# EasyEDA Pro project ease_eda.epro

# Schematic Schematic1
Board Name: Board1; Create Date: 2026-01-07; Page Name: P1; Project Name: QuizBox; Schematic Name: Schematic1; Update Date: 2026-01-18; Company: EasyEDA.com; Page Size: A4; Version: V1.0
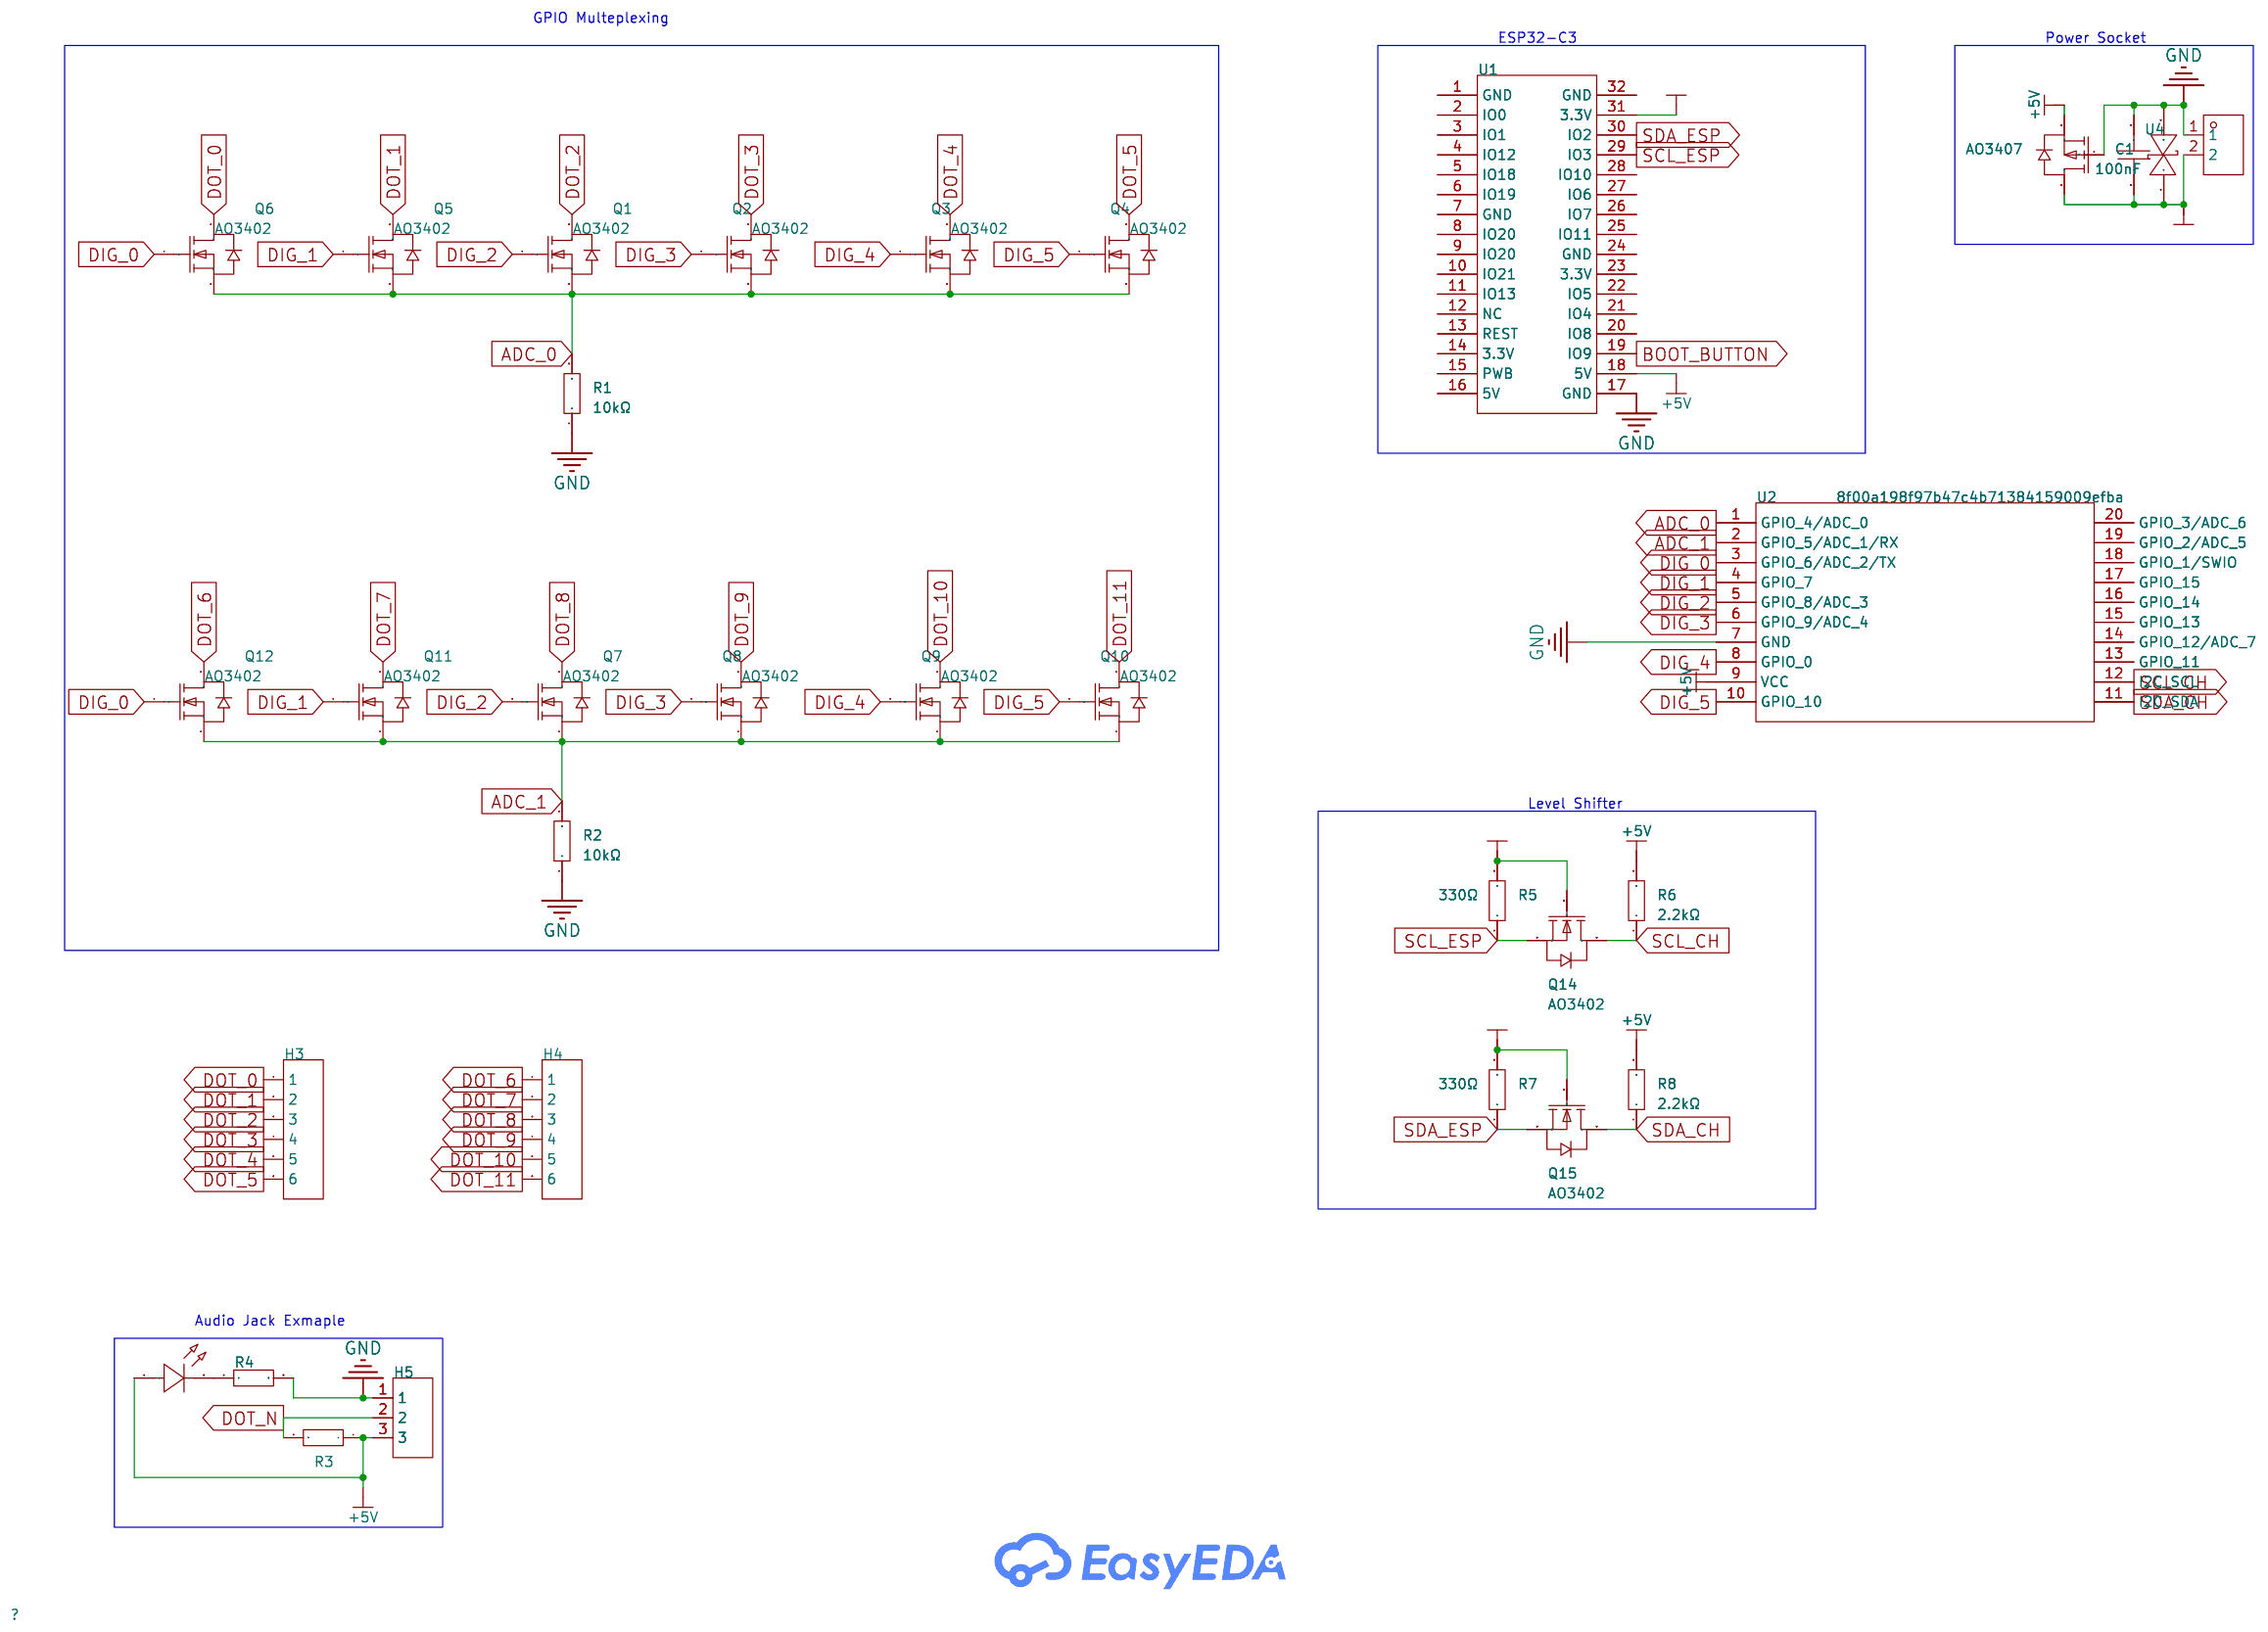
[diagram p0: schematic sheet]

## Parts
C1  100nF  [C1206]
H3  2.54-1x6P直针  [HDR-TH_6P-P2.54-V-M-1]
H4  2.54-1x6P直针  [HDR-TH_6P-P2.54-V-M-1]
H5  HX PH254-01-03-Z-L11.5 pcb pin header  [HDR-TH_3P-P2.54-V-M-1]
LED1  BL-BUB1V4V-AT  [LED-TH_BD5.8-P2.54-FD_RED]
Q1  AO3402  [SOT-23-3_L2.9-W1.3-P1.90-LS2.4-BR]
Q2  AO3402  [SOT-23-3_L2.9-W1.3-P1.90-LS2.4-BR]
Q3  AO3402  [SOT-23-3_L2.9-W1.3-P1.90-LS2.4-BR]
Q4  AO3402  [SOT-23-3_L2.9-W1.3-P1.90-LS2.4-BR]
Q5  AO3402  [SOT-23-3_L2.9-W1.3-P1.90-LS2.4-BR]
Q6  AO3402  [SOT-23-3_L2.9-W1.3-P1.90-LS2.4-BR]
Q7  AO3402  [SOT-23-3_L2.9-W1.3-P1.90-LS2.4-BR]
Q8  AO3402  [SOT-23-3_L2.9-W1.3-P1.90-LS2.4-BR]
Q9  AO3402  [SOT-23-3_L2.9-W1.3-P1.90-LS2.4-BR]
Q10  AO3402  [SOT-23-3_L2.9-W1.3-P1.90-LS2.4-BR]
Q11  AO3402  [SOT-23-3_L2.9-W1.3-P1.90-LS2.4-BR]
Q12  AO3402  [SOT-23-3_L2.9-W1.3-P1.90-LS2.4-BR]
Q13  AO3407  [SOT-23-3_L2.9-W1.3-P0.95-LS2.4-BR]
Q14  AO3402  [SOT-23-3_L2.9-W1.6-P1.90-LS2.8-BR]
Q15  AO3402  [SOT-23-3_L2.9-W1.6-P1.90-LS2.8-BR]
R1  10kΩ  [RES-TH_BD1.8-L3.2-P7.20-D0.4]
R2  10kΩ  [RES-TH_BD1.8-L3.2-P7.20-D0.4]
R3  10K  [R0603]
R4  10K  [R0603]
R5  330Ω  [RES-TH_BD1.8-L3.2-P7.20-D0.4]
R6  2.2kΩ  [RES-TH_BD1.8-L3.2-P7.20-D0.4]
R7  330Ω  [RES-TH_BD1.8-L3.2-P7.20-D0.4]
R8  2.2kΩ  [RES-TH_BD1.8-L3.2-P7.20-D0.4]
U1  -  [ESP32C3 LUATOS FOOT]
U2  8f00a198f97b47c4b71384159009efba  [DIP-20_L25.4-W17.7-P2.54-LS15.2-BL]
U3  KF301-5.0-2P  [CONN-TH_P5.00_KF301-5.0-2P]
U4  PESD5V0S1BA  [SOD-323_L1.7-W1.3-LS2.5-BI]

## Library data of the parts
C1 = CAP_0603: Supplier Footprint: 0603
H3 H4 = 2.54-1x6P直针: Pin Structure:1x6P Pitch:2.54mm Row Spacing:- Circluar Pins/Square Pins:Pin Header Mounting Type:Through Hole Number of Rows:1 Number of Pins:6P Current Rating:3A Voltage Rating (Max):- Length of Mating Pin:6mm Insulation Height:2.5mm Length of End Connec; LCSC Part Name: 1x6P 间距:2.54mm 方针 直插; Supplier Part: C37208; Manufacturer: BOOMELE(博穆精密); Supplier Footprint: 插件,P=2.54mm; JLCPCB Part Class: Extended Part; Datasheet: https://item.szlcsc.com/datasheet/2.54-1x6P%25E7%259B%25B4%25E9%2592%2588/38187.html; Supplier: LCSC; Pin Structure: 1x6P; Pitch: 2.54mm; Circluar Pins/Square Pins: Pin Header; Mounting Type: Through Hole; Number of Rows: 1; Number of Pins: 6P; Current Rating: 3A; Length of Mating Pin: 6mm; Insulation Height: 2.5mm; Length of End Connection Pin: 3mm; Contact Material: Brass; Contact Plating: Gold; Operating Temperature: -40℃~+105℃; Color: Black
H5 = HX PH254-01-03-Z-L11.5 pcb pin header: Pin Structure:1x3P Pitch:2.54mm Circluar Pins/Square Pins:Pin Header Mounting Type:Through Hole Number of Rows:1 Number of Pins:3P Current Rating:3A Voltage Rating (Max):1kV Length of Mating Pin:6mm Insulation Height:2.5mm Length of End Connection Pin:3mm; LCSC Part Name: 1x3P 间距:2.54mm 方针 直插; Supplier Part: C52016391; Manufacturer: hanxia(韩下); Supplier Footprint: 插件,P=2.54mm; JLCPCB Part Class: Extended Part; Datasheet: https://item.szlcsc.com/datasheet/HX%2520PH254-01-03-Z-L11.5%2520pcb%2520pin%2520header/54760436.html; Supplier: LCSC; Pin Structure: 1x3P; Pitch: 2.54mm; Circluar Pins/Square Pins: Pin Header; Mounting Type: Through Hole; Number of Rows: 1; Number of Pins: 3P; Current Rating: 3A; Voltage Rating (Max): 1kV; Length of Mating Pin: 6mm; Insulation Height: 2.5mm; Length of End Connection Pin: 3mm; Contact Material: Brass; Contact Plating: Gold; Operating Temperature: -40℃~+105℃
LED1 = BL-BUB1V4V-AT: Illumination Color:Red Forward Current:-; LCSC Part Name: F4.98红发红红光; Supplier Part: C7421379; Manufacturer: BrtLed(佰鸿); Supplier Footprint: 插件; JLCPCB Part Class: Extended Part; Datasheet: https://item.szlcsc.com/datasheet/BL-BUB1V4V-AT/8401795.html; Supplier: LCSC; Illumination Color: Red
Q1-Q12 = AO3402_C50176481: Drain to Source Voltage:30V Current - Continuous Drain(Id):4.2A RDS(on):38mΩ@10V Gate Threshold Voltage (Vgs(th)):800mV Gate Charge(Qg):3.1nC@4.5V Input Capacitance(Ciss):240pF Reverse Transfer Capacitance (Crss@Vds):30pF Type:N-Channel Output Capacitance; Supplier Part: C50176481; Manufacturer: SEP(威旺); Supplier Footprint: SOT-23; JLCPCB Part Class: Extended Part; Datasheet: https://item.szlcsc.com/datasheet/AO3402/52750371.html; Supplier: LCSC; Drain to Source Voltage: 30V; Current - Continuous Drain(Id): 4.2A; RDS(on): 38mΩ@10V; Gate Threshold Voltage (Vgs(th)): 800mV; Gate Charge(Qg): 3.1nC@4.5V; Input Capacitance(Ciss): 240pF; Reverse Transfer Capacitance (Crss@Vds): 30pF; Type: N-Channel; Output Capacitance(Coss): 35pF
Q13 = AO3407_C5370970: Drain to Source Voltage:30V Current - Continuous Drain(Id):4.1A RDS(on):55mΩ@10V Pd - Power Dissipation:1.51W Gate Threshold Voltage (Vgs(th)):1.5V Gate Charge(Qg):6.8nC@10V Input Capacitance(Ciss):580pF@15V Reverse Transfer Capacitance (Crss@Vds):74pF@15; LCSC Part Name: 耐压:30V 电流:4.1A; Supplier Part: C5370970; Manufacturer: TECH PUBLIC(台舟); Supplier Footprint: SOT-23-3; JLCPCB Part Class: Extended Part; Datasheet: https://item.szlcsc.com/datasheet/AO3407/6218007.html; Supplier: LCSC; Drain to Source Voltage: 30V; Current - Continuous Drain(Id): 4.1A; RDS(on): 55mΩ@10V; Pd - Power Dissipation: 1.51W; Gate Threshold Voltage (Vgs(th)): 1.5V; Gate Charge(Qg): 6.8nC@10V; Input Capacitance(Ciss): 580pF@15V; Reverse Transfer Capacitance (Crss@Vds): 74pF@15V; Operating Temperature: -55℃~+150℃; Output Capacitance(Coss): 98pF
Q14 Q15 = AO3402_C5379095: Number:1 N-Channel Drain to Source Voltage:30V Current - Continuous Drain(Id):4A RDS(on):47mΩ@4.5V Pd - Power Dissipation:1.4W Gate Threshold Voltage (Vgs(th)):900mV@250uA Gate Charge(Qg):8.4nC@4.5V Input Capacitance(Ciss):695pF Reverse Transfer Capacitan; LCSC Part Name: 1个N沟道 耐压:30V 电流:4A; Supplier Part: C5379095; Manufacturer: MSKSEMI(美森科); Supplier Footprint: SOT-23-3L; JLCPCB Part Class: Extended Part; Datasheet: https://item.szlcsc.com/datasheet/AO3402/6243219.html; Supplier: LCSC; Number: 1 N-Channel; Drain to Source Voltage: 30V; Current - Continuous Drain(Id): 4A; RDS(on): 47mΩ@4.5V; Pd - Power Dissipation: 1.4W; Gate Threshold Voltage (Vgs(th)): 900mV@250uA; Gate Charge(Qg): 8.4nC@4.5V; Input Capacitance(Ciss): 695pF; Reverse Transfer Capacitance (Crss@Vds): 36pF; Operating Temperature: -55℃~+150℃; Output Capacitance(Coss): 45pF
R1 R2 R5-R8 = Res_AXIAL-1/8W: Supplier Footprint: Through
R3 R4 = Res_0603: Supplier Footprint: 0603
U1 = ESP32-C3-LUATOS
U2 = CH32V003_EXPANDER
U3 = KF301-5.0-2P: Number of Positions or Pins:1x2P Pitch:5mm Color:Blue Mounting Type:Through Hole Number of Pins:2P Number of Rows:1 Number of PINs Per Row:2 Current Rating:17A Voltage Rating (Max):250V Wire Gauge - AWG:14~22 Wire Gauge - mm2:1.5 Wire Gauge - mm2:1.5 Oper; LCSC Part Name: 1x2P 5mm 直插 排数:1 每排P数:2; Supplier Part: C474881; Manufacturer: KEFA(科发); Supplier Footprint: 插件,P=5mm; JLCPCB Part Class: Extended Part; Datasheet: https://item.szlcsc.com/datasheet/KF301-5.0-2P/481499.html; Supplier: LCSC; Number of Positions or Pins: 1x2P; Pitch: 5mm; Color: Blue; Mounting Type: Through Hole; Number of Pins: 2P; Number of Rows: 1; Number of PINs Per Row: 2; Current Rating: 17A; Voltage Rating (Max): 250V; Wire Gauge - AWG: 14~22; Wire Gauge - mm2: 1.5; Operating Temperature: -30℃~+120℃
U4 = PESD5V0S1BA_C5449138: Polarity:Bidirectional Reverse Stand-Off Voltage (Vrwm):5V Clamping Voltage:16V Peak Pulse Current (Ipp):8A Peak Pulse Power Dissipation (Ppp):100W Voltage - Breakdown:7.8V Reverse Leakage Current (Ir):1uA Number of Channels:1 Operating Temperature:-40℃~+; LCSC Part Name: 双向 ESD 5V截止 峰值浪涌电流：8A; Supplier Part: C5449138; Manufacturer: KUU; Supplier Footprint: SOD-323; JLCPCB Part Class: Extended Part; Datasheet: https://item.szlcsc.com/datasheet/PESD5V0S1BA/6351317.html; Supplier: LCSC; Polarity: Bidirectional; Reverse Stand-Off Voltage (Vrwm): 5V; Clamping Voltage: 16V; Peak Pulse Current (Ipp): 8A; Peak Pulse Power Dissipation (Ppp): 100W; Voltage - Breakdown: 7.8V; Reverse Leakage Current (Ir): 1uA; Number of Channels: 1; Operating Temperature: -40℃~+150℃@(Tj); level of protection: IEC 61000-4-2；IEC 61000-4-4; Type: ESD; Junction Capacitance: 10pF

## Nets
+3.3V: Q14.1(G) Q15.1(G) R5.2 R7.2 U1.31(3.3V)
+5V: H5.3 LED1.1(A) Q13.2(S) R3.1 R6.2 R8.2 U1.18(5V) U2.9(VCC)
GND: C1.1 H5.1 Q13.1(G) R1.1 R2.1 R4.2 U1.17(GND) U2.7(GND) U3.1 U4.2
VIN: C1.2 Q13.3(D) U3.2 U4.1
ADC_0: Q1.2(S) Q2.2(S) Q3.2(S) Q4.2(S) Q5.2(S) Q6.2(S) R1.2 U2.1(GPIO_4/ADC_0)
ADC_1: Q7.2(S) Q8.2(S) Q9.2(S) Q10.2(S) Q11.2(S) Q12.2(S) R2.2 U2.2(GPIO_5/ADC_1/RX)
BOOT_BUTTON: U1.19(IO9)
DIG_0: Q6.1(G) Q12.1(G) U2.3(GPIO_6/ADC_2/TX)
DIG_1: Q5.1(G) Q11.1(G) U2.4(GPIO_7)
DIG_2: Q1.1(G) Q7.1(G) U2.5(GPIO_8/ADC_3)
DIG_3: Q2.1(G) Q8.1(G) U2.6(GPIO_9/ADC_4)
DIG_4: Q3.1(G) Q9.1(G) U2.8(GPIO_0)
DIG_5: Q4.1(G) Q10.1(G) U2.10(GPIO)
DOT_0: H3.1 Q6.3(D)
DOT_1: H3.2 Q5.3(D)
DOT_2: H3.3 Q1.3(D)
DOT_3: H3.4 Q2.3(D)
DOT_4: H3.5 Q3.3(D)
DOT_5: H3.6 Q4.3(D)
DOT_6: H4.1 Q12.3(D)
DOT_7: H4.2 Q11.3(D)
DOT_8: H4.3 Q7.3(D)
DOT_9: H4.4 Q8.3(D)
DOT_10: H4.5 Q9.3(D)
DOT_11: H4.6 Q10.3(D)
DOT_N: H5.2 R3.2
SCL_CH: Q14.3(D) R6.1 U2.12(I2C_SCL)
SCL_ESP: Q14.2(S) R5.1 U1.29(IO3)
SDA_CH: Q15.3(D) R8.1 U2.11(I2C_SDA)
SDA_ESP: Q15.2(S) R7.1 U1.30(IO2)
Net-(LED1-2): LED1.2(K) R4.1

Not connected (* = marked no-connect by the designer): U1 1(GND) 2(IO0) 3(IO1) 4(IO12) 5(IO18) 6(IO19) 7(GND) 8(IO20) 9(IO20) 10(IO21) 11(IO13) 12(NC) 13(REST) 14(3.3V) 15(PWB) 16(5V) 20(IO8) 21(IO4) 22(IO5) 23(3.3V) 24(GND) 25(IO11) 26(IO7) 27(IO6) 28(IO10) 32(GND); U2 13(GPIO_11) 14(GPIO_12/ADC_7) 15(GPIO_13) 16(GPIO_14) 17(GPIO_15) 18(GPIO_1/SWIO) 19(GPIO_2/ADC_5) 20(GPIO_3/ADC_6)

## Notes on the sheet
- GPIO Multeplexing
- ESP32-C3
- Power Socket
- Level Shifter
- Audio Jack Exmaple

# Schematic Schematic2
Board Name: Board2; Create Date: 2026-02-21; Page Name: P1; Project Name: QuizBox; Schematic Name: Schematic2; Update Date: 2026-02-27; Company: EasyEDA.com; Page Size: A4; Version: V1.0
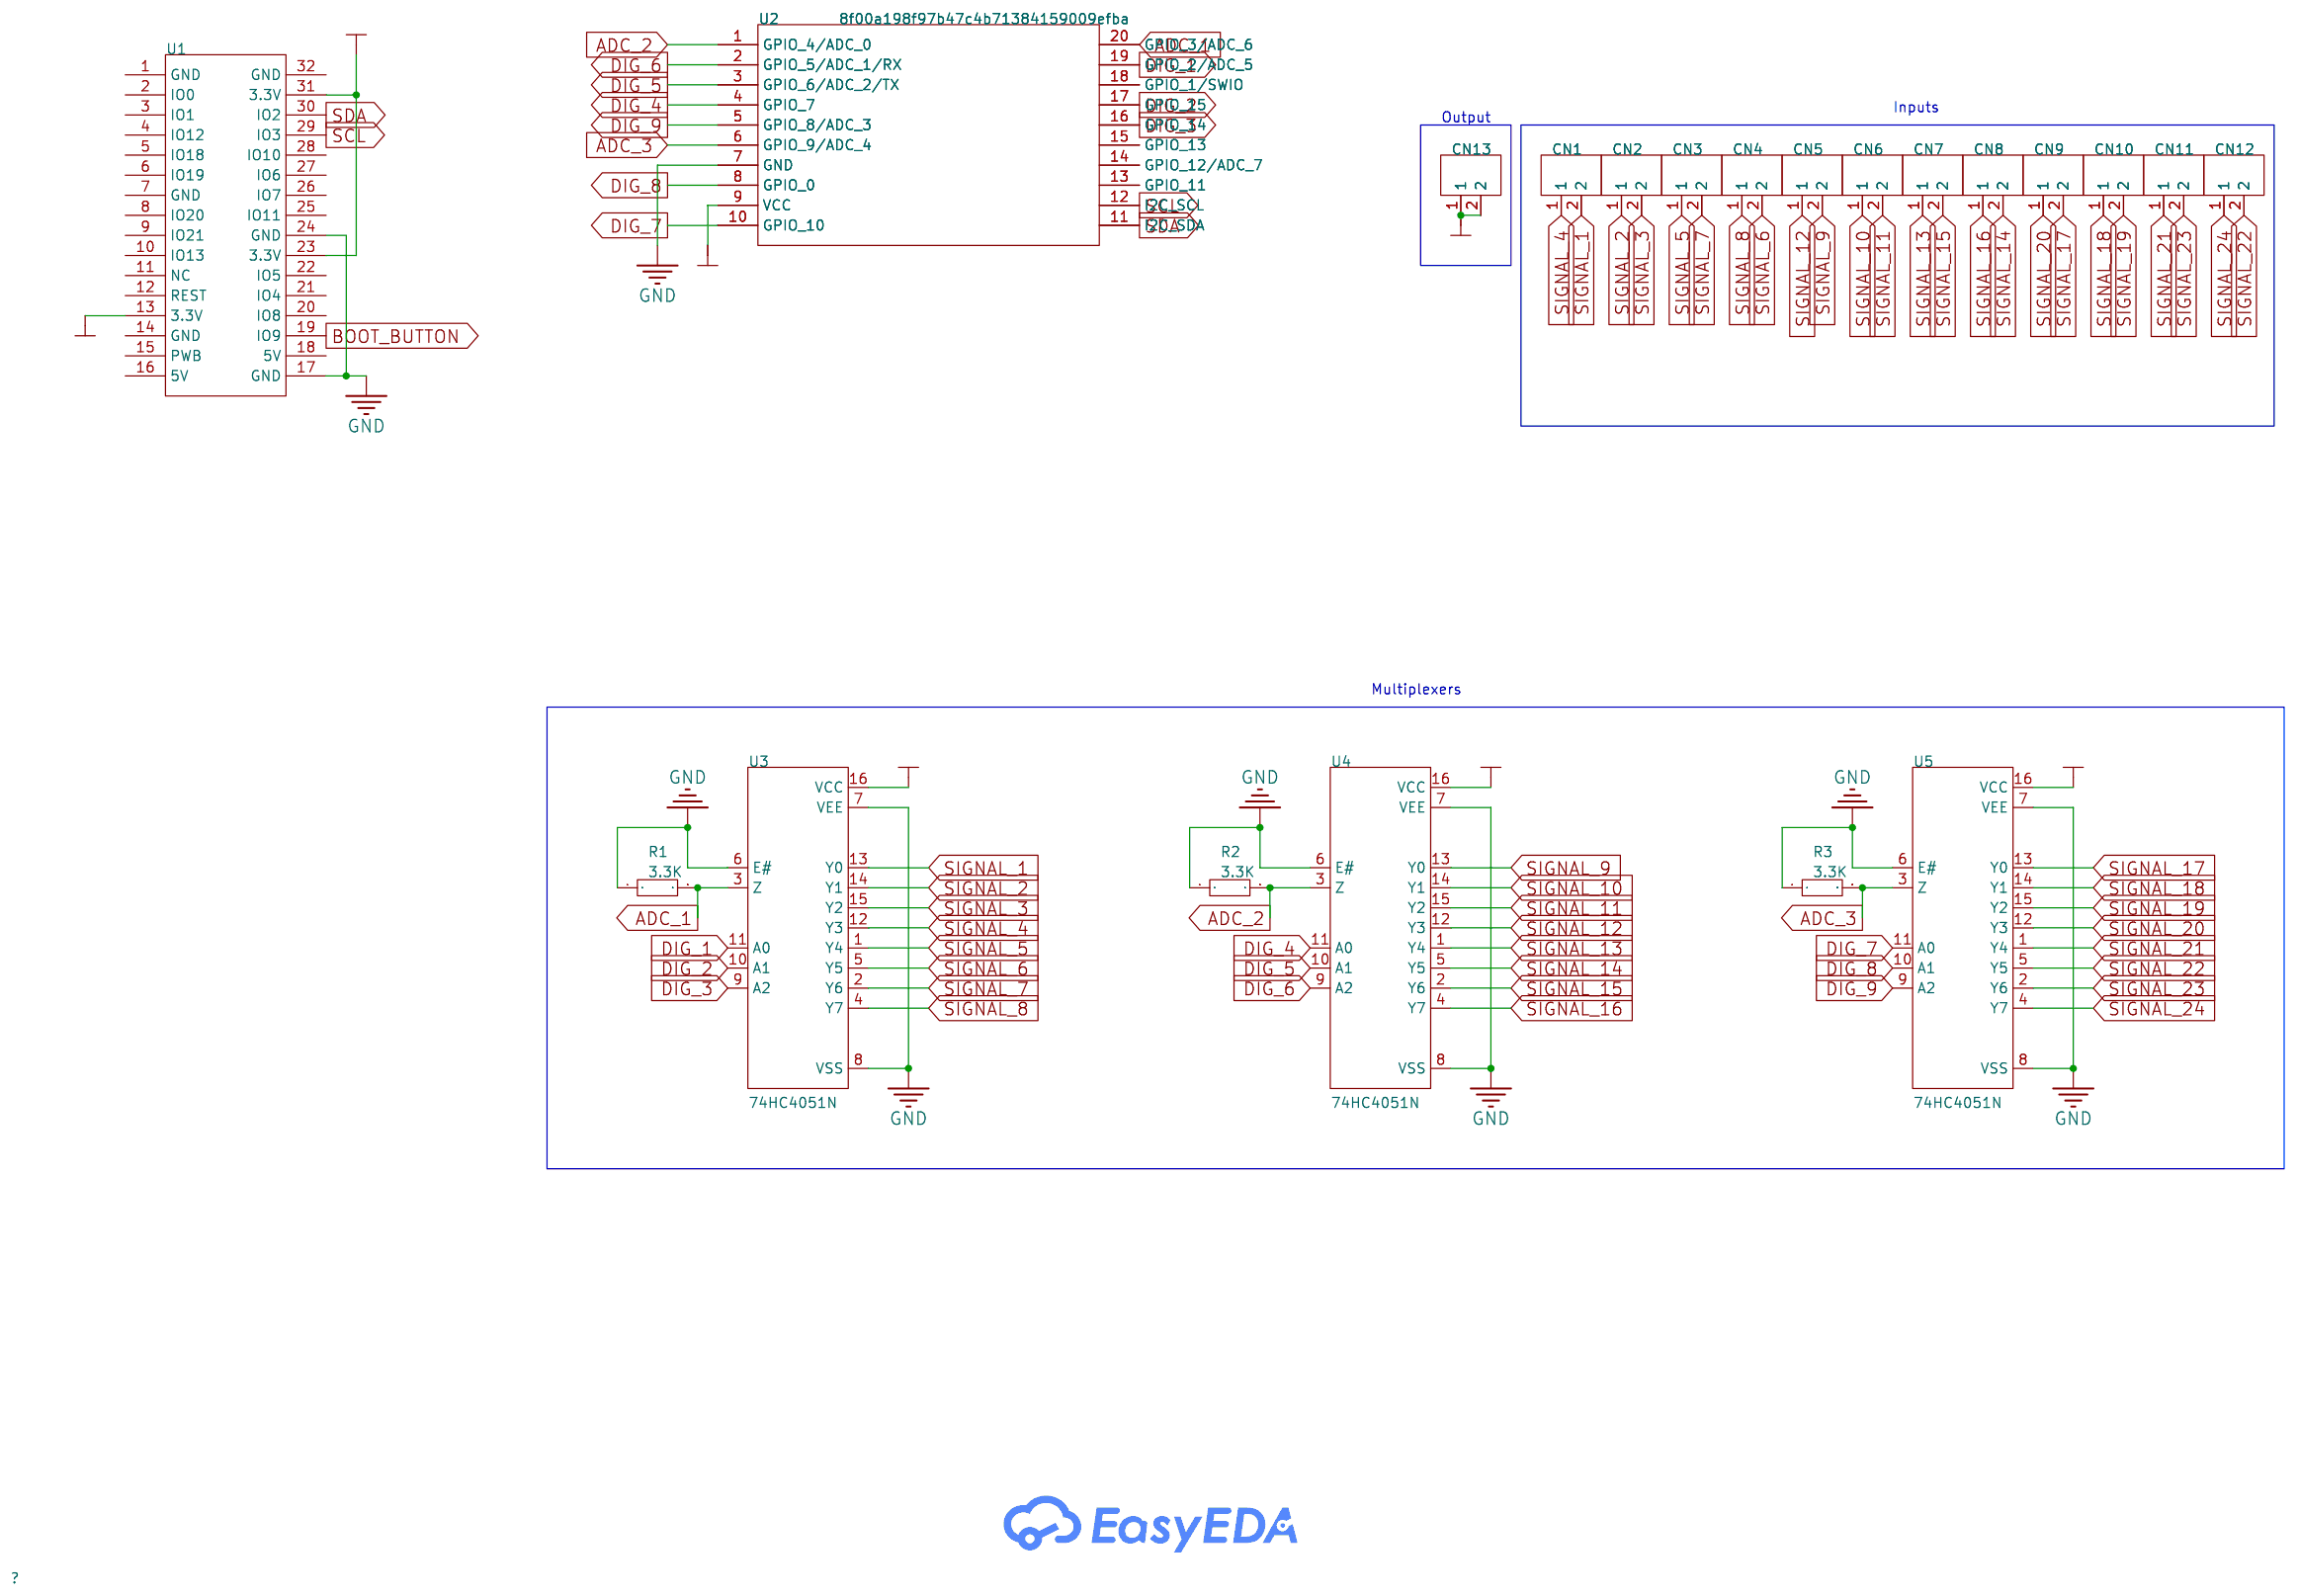
[diagram p1: schematic sheet]

## Parts
CN1  DGL500-2P26V-MG561  [CONN-TH_2P-P5.00_DGL500-2P26V-MG561]
CN2  DGL500-2P26V-MG561  [CONN-TH_2P-P5.00_DGL500-2P26V-MG561]
CN3  DGL500-2P26V-MG561  [CONN-TH_2P-P5.00_DGL500-2P26V-MG561]
CN4  DGL500-2P26V-MG561  [CONN-TH_2P-P5.00_DGL500-2P26V-MG561]
CN5  DGL500-2P26V-MG561  [CONN-TH_2P-P5.00_DGL500-2P26V-MG561]
CN6  DGL500-2P26V-MG561  [CONN-TH_2P-P5.00_DGL500-2P26V-MG561]
CN7  DGL500-2P26V-MG561  [CONN-TH_2P-P5.00_DGL500-2P26V-MG561]
CN8  DGL500-2P26V-MG561  [CONN-TH_2P-P5.00_DGL500-2P26V-MG561]
CN9  DGL500-2P26V-MG561  [CONN-TH_2P-P5.00_DGL500-2P26V-MG561]
CN10  DGL500-2P26V-MG561  [CONN-TH_2P-P5.00_DGL500-2P26V-MG561]
CN11  DGL500-2P26V-MG561  [CONN-TH_2P-P5.00_DGL500-2P26V-MG561]
CN12  DGL500-2P26V-MG561  [CONN-TH_2P-P5.00_DGL500-2P26V-MG561]
CN13  DGL500-2P26V-MG561  [CONN-TH_2P-P5.00_DGL500-2P26V-MG561]
R1  3.3K  [RES-TH_BD1.8-L3.2-P7.20-D0.4]
R2  3.3K  [RES-TH_BD1.8-L3.2-P7.20-D0.4]
R3  3.3K  [RES-TH_BD1.8-L3.2-P7.20-D0.4]
U1  -  [ESP32C3 LUATOS FOOT]
U2  8f00a198f97b47c4b71384159009efba  [DIP-20_L25.4-W17.7-P2.54-LS15.2-BL]
U3  74HC4051N  [PDIP-16_L19.3-W6.4-P2.54-LS7.94-BL]
U4  74HC4051N  [PDIP-16_L19.3-W6.4-P2.54-LS7.94-BL]
U5  74HC4051N  [PDIP-16_L19.3-W6.4-P2.54-LS7.94-BL]

## Library data of the parts
CN1-CN13 = DGL500-2P26V-MG561: Number of Positions or Pins:1x2P Pitch:5mm Color:Green Mounting Type:Through Hole Number of Pins:2P Number of Rows:1 Number of PINs Per Row:2 Screw Specification:- Current Rating:18A Voltage Rating (Max):250V Wire Gauge - AWG:14~26 Wire Gauge - mm2:0.5~2.; LCSC Part Name: 1x2P 5mm 直插 排数:1 每排P数:2; Supplier Part: C49286620; Manufacturer: XUNPU(讯普); Supplier Footprint: 插件,P=5mm; JLCPCB Part Class: Extended Part; Datasheet: https://item.szlcsc.com/datasheet/DGL500-2P26V-MG561/51736379.html; Supplier: LCSC; Number of Positions or Pins: 1x2P; Pitch: 5mm; Color: Green; Mounting Type: Through Hole; Number of Pins: 2P; Number of Rows: 1; Number of PINs Per Row: 2; Current Rating: 18A; Voltage Rating (Max): 250V; Wire Gauge - AWG: 14~26; Wire Gauge - mm2: 0.5~2.5; Operating Temperature: -40℃~+105℃
R1-R3 = Res_0603: Supplier Footprint: 0603
U1 = ESP32-C3-LUATOS
U2 = CH32V003_EXPANDER
U3-U5 = 74HC4051N: Switch Circuit:8:1 Number of Channels:- Voltage - Supply:3V~9V Voltage - Supply:3V~9V Turn-on time:- Ron:350Ω Turn-off time:290ns Operating Temperature:-40℃~+85℃ Operating Temperature:-40℃~+85℃ Propagation Delay (tpd):30ns; LCSC Part Name: 74HC4051 八选一模拟开关; Supplier Part: C22461600; Manufacturer: HGSEMI(华冠); Supplier Footprint: DIP-16; JLCPCB Part Class: Extended Part; Datasheet: https://item.szlcsc.com/datasheet/74HC4051N/24141305.html; Supplier: LCSC; Switch Circuit: 8:1; Voltage - Supply: 3V~9V; Ron: 350Ω; Turn-off time: 290ns; Operating Temperature: -40℃~+85℃; Propagation Delay (tpd): 30ns

## Nets
+3.3V: CN13.1 CN13.2 U1.13(3.3V) U1.23(3.3V) U1.31(3.3V) U2.9(VCC) U3.16(VCC) U4.16(VCC) U5.16(VCC)
GND: R1.1 R2.1 R3.1 U1.17(GND) U1.24(GND) U2.7(GND) U3.6(E#) U3.7(VEE) U3.8(VSS) U4.6(E#) U4.7(VEE) U4.8(VSS) U5.6(E#) U5.7(VEE) U5.8(VSS)
ADC_1: R1.2 U2.20(GPIO_3/ADC_6) U3.3(Z)
ADC_2: R2.2 U2.1(GPIO_4/ADC_0) U4.3(Z)
ADC_3: R3.2 U2.6(GPIO_9/ADC_4) U5.3(Z)
BOOT_BUTTON: U1.19(IO9)
DIG_1: U2.19(GPIO_2/ADC_5) U3.11(A0)
DIG_2: U2.17(GPIO_15) U3.10(A1)
DIG_3: U2.16(GPIO_14) U3.9(A2)
DIG_4: U2.4(GPIO_7) U4.11(A0)
DIG_5: U2.3(GPIO_6/ADC_2/TX) U4.10(A1)
DIG_6: U2.2(GPIO_5/ADC_1/RX) U4.9(A2)
DIG_7: U2.10(GPIO) U5.11(A0)
DIG_8: U2.8(GPIO_0) U5.10(A1)
DIG_9: U2.5(GPIO_8/ADC_3) U5.9(A2)
SCL: U1.29(IO3) U2.12(I2C_SCL)
SDA: U1.30(IO2) U2.11(I2C_SDA)
SIGNAL_1: CN1.2 U3.13(Y0)
SIGNAL_2: CN2.1 U3.14(Y1)
SIGNAL_3: CN2.2 U3.15(Y2)
SIGNAL_4: CN1.1 U3.12(Y3)
SIGNAL_5: CN3.1 U3.1(Y4)
SIGNAL_6: CN4.2 U3.5(Y5)
SIGNAL_7: CN3.2 U3.2(Y6)
SIGNAL_8: CN4.1 U3.4(Y7)
SIGNAL_9: CN5.2 U4.13(Y0)
SIGNAL_10: CN6.1 U4.14(Y1)
SIGNAL_11: CN6.2 U4.15(Y2)
SIGNAL_12: CN5.1 U4.12(Y3)
SIGNAL_13: CN7.1 U4.1(Y4)
SIGNAL_14: CN8.2 U4.5(Y5)
SIGNAL_15: CN7.2 U4.2(Y6)
SIGNAL_16: CN8.1 U4.4(Y7)
SIGNAL_17: CN9.2 U5.13(Y0)
SIGNAL_18: CN10.1 U5.14(Y1)
SIGNAL_19: CN10.2 U5.15(Y2)
SIGNAL_20: CN9.1 U5.12(Y3)
SIGNAL_21: CN11.1 U5.1(Y4)
SIGNAL_22: CN12.2 U5.5(Y5)
SIGNAL_23: CN11.2 U5.2(Y6)
SIGNAL_24: CN12.1 U5.4(Y7)

Not connected (* = marked no-connect by the designer): U1 1(GND) 2(IO0) 3(IO1) 4(IO12) 5(IO18) 6(IO19) 7(GND) 8(IO20) 9(IO21) 10(IO13) 11(NC) 12(REST) 14(GND) 15(PWB) 16(5V) 18(5V) 20(IO8) 21(IO4) 22(IO5) 25(IO11) 26(IO7) 27(IO6) 28(IO10) 32(GND); U2 13(GPIO_11) 14(GPIO_12/ADC_7) 15(GPIO_13) 18(GPIO_1/SWIO)

## Notes on the sheet
- Output
- Inputs
- Multiplexers

# Board PCB1
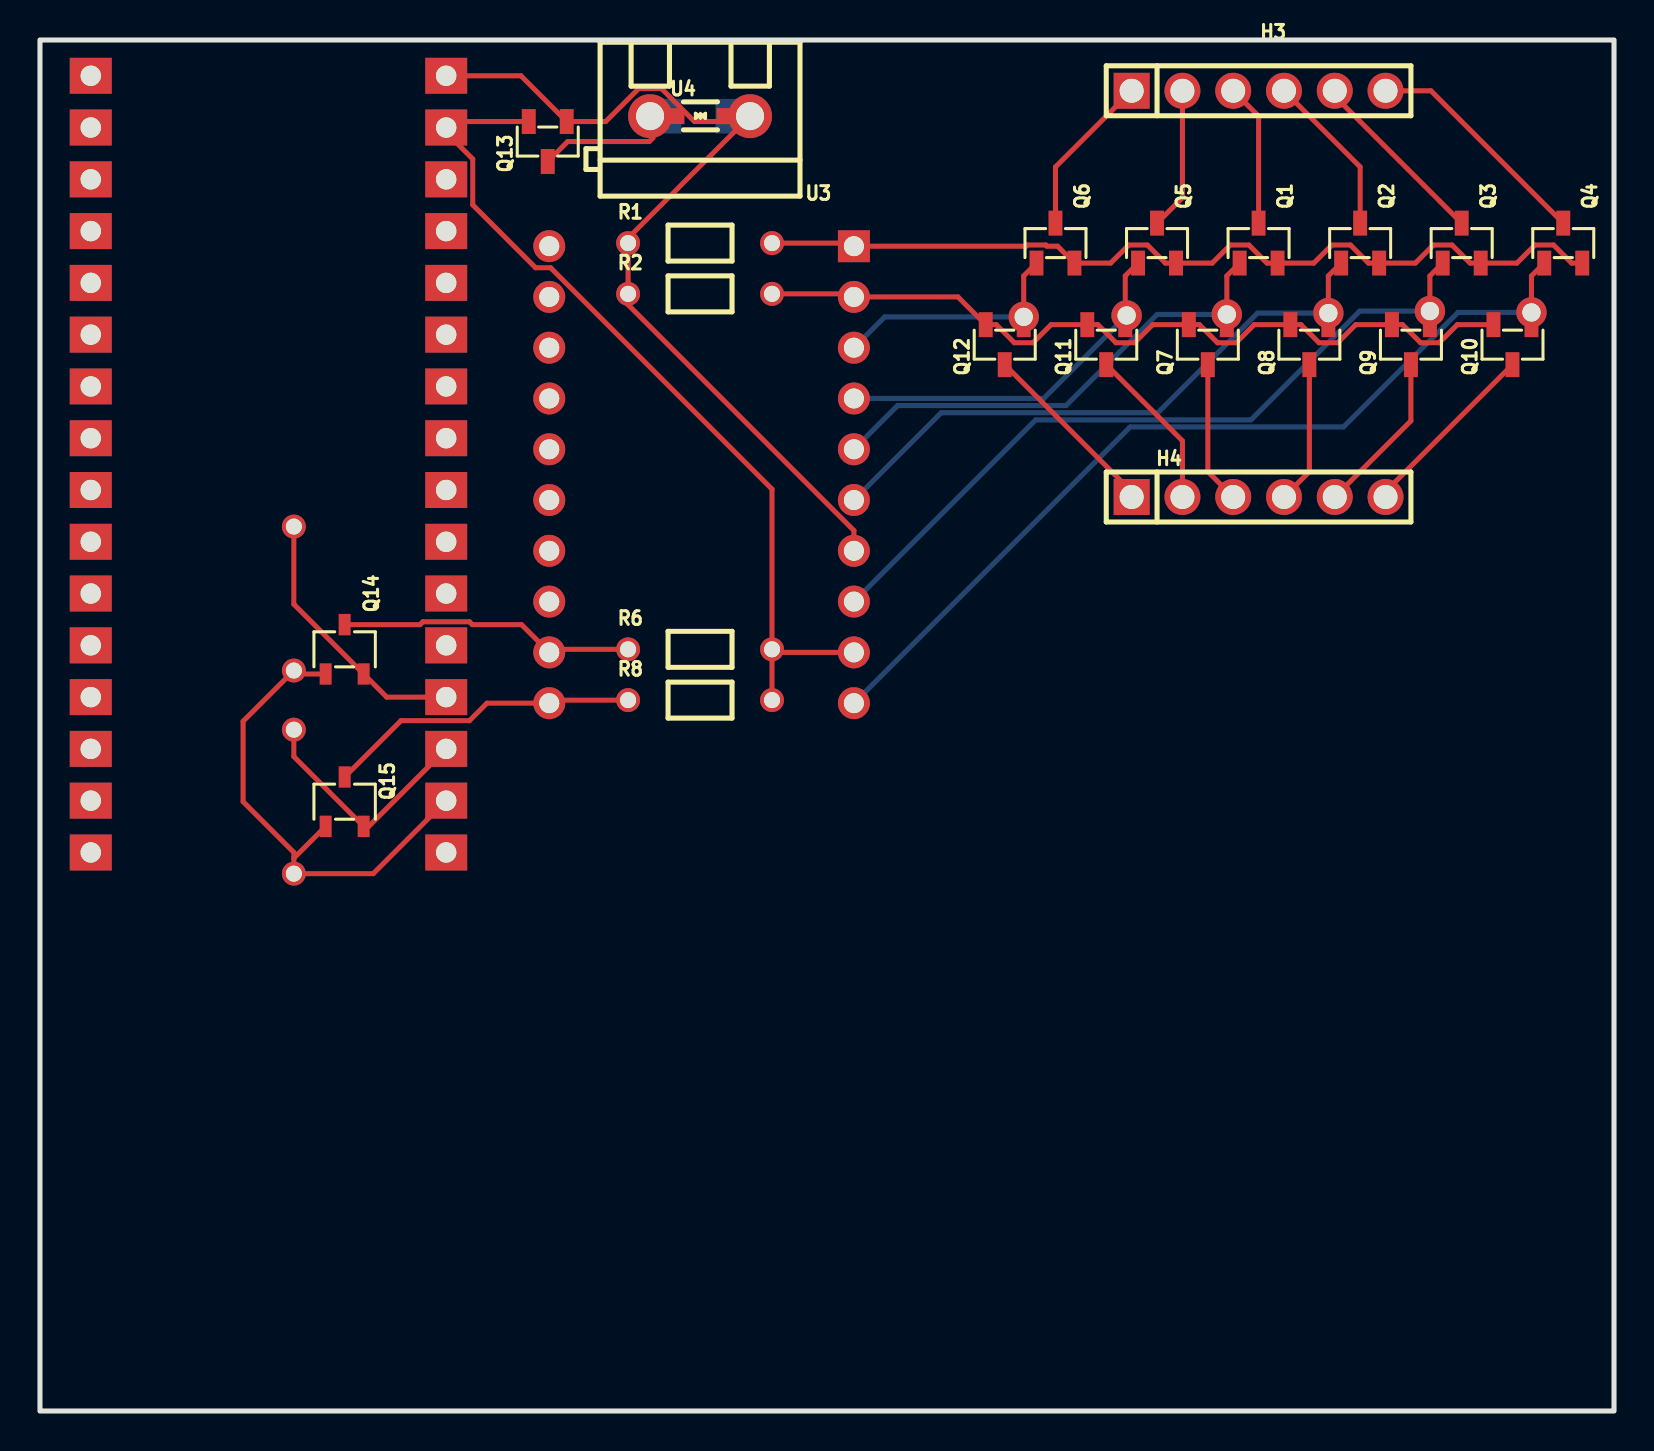
[diagram p2: board, top side]
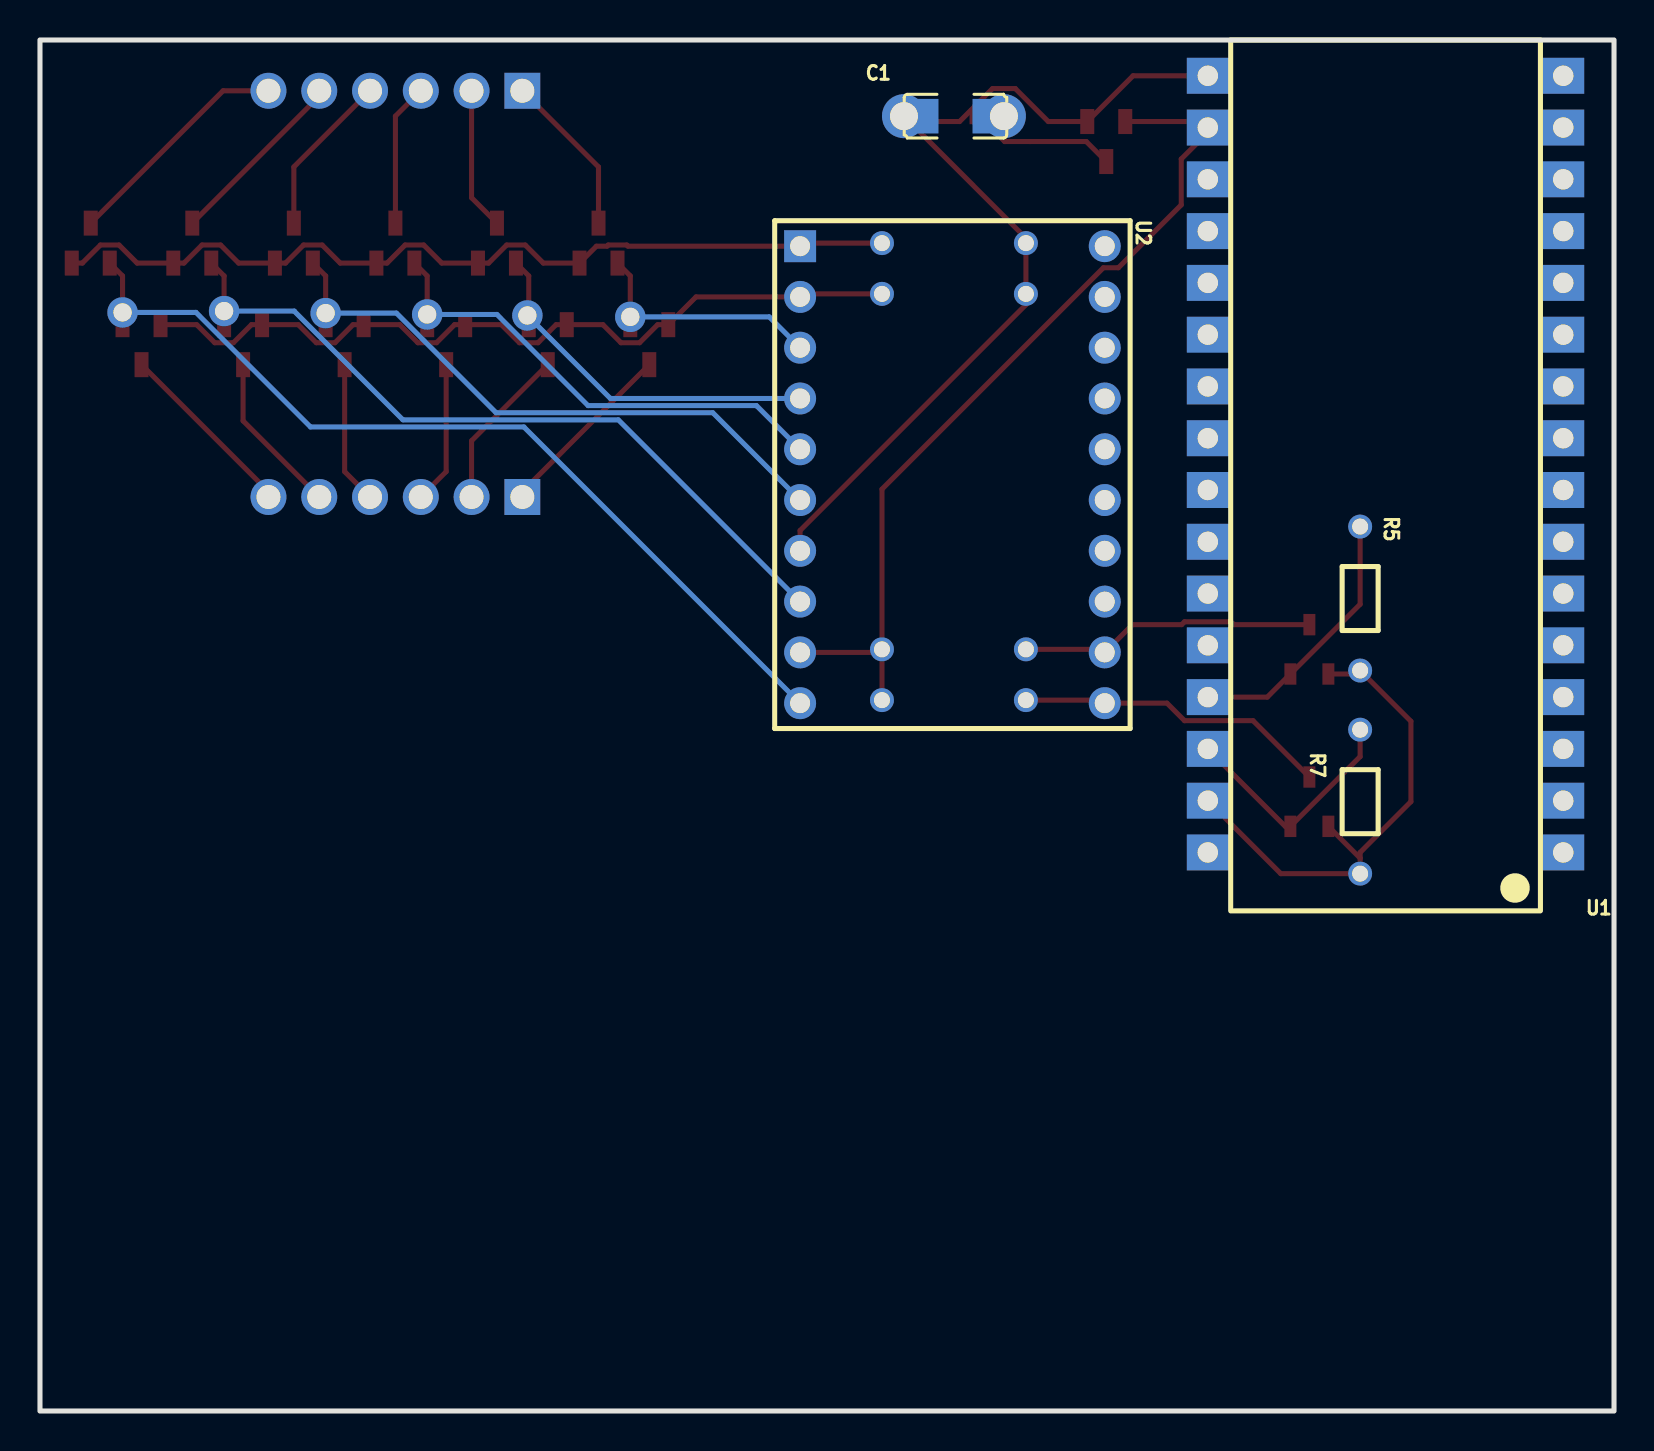
[diagram p3: board, bottom side, seen from below]

Outline 78.74 x 68.58 mm; copper layers: Top Layer, Bottom Layer. Coordinates in mm from the lower left corner of the outline.
Outline path: rectangle 0,68.58 78.74,0
Stack: Top Layer 0.035mm / Dielectric1 1.51mm FR4 er 4.5 / Bottom Layer 0.035mm

## Design rules (mm)
template: JLCPCB Capability(Two Layers Board)
spacing copperThickness1oz (default): track to track 0.102, other pairs 0.152 to 0.3
spacing copperThickness2oz: track to track 0.203, other pairs 0.152 to 0.3
track width copperThickness1oz (default): min 0.127, default 0.254, max 2.54
track width copperThickness2oz: min 0.203, default 0.254, max 2.54
differential pair differentialPair (default): width min 0.127, default 0.254, max 2.54; gap min 0.152, default 0.152
via viaSize (default): diameter min 0.5, default 0.61, max 10; hole min 0.3, default 0.305, max 6.3

## Placement (name value [footprint] x y rotation side)
C1  100nF  [C1206]  32.94 64.77 180 bottom
H3  2.54-1x6P直针  [HDR-TH_6P-P2.54-V-M-1]  60.96 66.04 0 top
H4  2.54-1x6P直针  [HDR-TH_6P-P2.54-V-M-1]  60.96 45.72 0 top
NOREF  -  [Pad_e253]  59.37 54.85 0 top
NOREF#2  -  [Pad_e328]  49.21 54.73 0 top
NOREF#3  -  [Pad_e255]  69.53 55.02 0 top
NOREF#4  -  [Pad_e254]  64.45 54.92 0 top
NOREF#5  -  [Pad_e252]  54.36 54.8 0 top
NOREF#6  -  [Pad_e256]  74.61 54.95 0 top
Q1  AO3402  [SOT-23-3_L2.9-W1.3-P1.90-LS2.4-BR]  60.96 58.42 270 top
Q2  AO3402  [SOT-23-3_L2.9-W1.3-P1.90-LS2.4-BR]  66.04 58.42 270 top
Q3  AO3402  [SOT-23-3_L2.9-W1.3-P1.90-LS2.4-BR]  71.12 58.42 270 top
Q4  AO3402  [SOT-23-3_L2.9-W1.3-P1.90-LS2.4-BR]  76.2 58.42 270 top
Q5  AO3402  [SOT-23-3_L2.9-W1.3-P1.90-LS2.4-BR]  55.88 58.42 270 top
Q6  AO3402  [SOT-23-3_L2.9-W1.3-P1.90-LS2.4-BR]  50.8 58.42 270 top
Q7  AO3402  [SOT-23-3_L2.9-W1.3-P1.90-LS2.4-BR]  58.42 53.34 90 top
Q8  AO3402  [SOT-23-3_L2.9-W1.3-P1.90-LS2.4-BR]  63.5 53.34 90 top
Q9  AO3402  [SOT-23-3_L2.9-W1.3-P1.90-LS2.4-BR]  68.58 53.34 90 top
Q10  AO3402  [SOT-23-3_L2.9-W1.3-P1.90-LS2.4-BR]  73.66 53.34 90 top
Q11  AO3402  [SOT-23-3_L2.9-W1.3-P1.90-LS2.4-BR]  53.34 53.34 90 top
Q12  AO3402  [SOT-23-3_L2.9-W1.3-P1.90-LS2.4-BR]  48.26 53.34 90 top
Q13  AO3407  [SOT-23-3_L2.9-W1.3-P0.95-LS2.4-BR]  25.4 63.5 90 top
Q14  AO3402  [SOT-23-3_L2.9-W1.6-P1.90-LS2.8-BR]  15.24 38.1 270 top
Q15  AO3402  [SOT-23-3_L2.9-W1.6-P1.90-LS2.8-BR]  15.24 30.48 270 top
R1  10kΩ  [RES-TH_BD1.8-L3.2-P7.20-D0.4]  33.02 58.42 0 top
R2  10kΩ  [RES-TH_BD1.8-L3.2-P7.20-D0.4]  33.02 55.88 0 top
R5  330Ω  [RES-TH_BD1.8-L3.2-P7.20-D0.4]  12.7 40.64 270 bottom
R6  2.2kΩ  [RES-TH_BD1.8-L3.2-P7.20-D0.4]  33.02 38.1 0 top
R7  330Ω  [RES-TH_BD1.8-L3.2-P7.20-D0.4]  12.7 30.48 270 bottom
R8  2.2kΩ  [RES-TH_BD1.8-L3.2-P7.20-D0.4]  33.02 35.56 0 top
U1  -  [ESP32C3 LUATOS FOOT]  2.54 27.94 0 bottom
U2  8f00a198f97b47c4b71384159009efba  [DIP-20_L25.4-W17.7-P2.54-LS15.2-BL]  33.1 46.84 270 bottom
U3  KF301-5.0-2P  [CONN-TH_P5.00_KF301-5.0-2P]  33.02 64.77 180 top
U4  PESD5V0S1BA  [SOD-323_L1.7-W1.3-LS2.5-BI]  33.05 64.77 0 top

## Footprints (pads in the part's own frame, mm; a bottom-side part is the same pattern mirrored in y, then rotated)
C1206
  rect 1.485x1.728 smd: 1(-1.593,0) 2(1.593,0)
CONN-TH_P5.00_KF301-5.0-2P
  round 2.2 hole 1.4: 1(-2.5,0) 2(2.5,0)
DIP-20_L25.4-W17.7-P2.54-LS15.2-BL
  rect 1.6x1.6 hole 1: 1(-11.428,-7.62)
  round 1.6 hole 1: 2(-8.89,-7.62) 3(-6.35,-7.62) 4(-3.81,-7.62) 5(-1.27,-7.62) 6(1.27,-7.62) 7(3.81,-7.62) 8(6.35,-7.62) 9(8.89,-7.62) 10(11.43,-7.62) 11(11.43,7.62) 12(8.89,7.62) 13(6.35,7.62) 14(3.81,7.62) 15(1.27,7.62) 16(-1.27,7.62) 17(-3.81,7.62) 18(-6.35,7.62) 19(-8.89,7.62) 20(-11.43,7.62)
ESP32C3 LUATOS FOOT
  rect 2.1x1.8 hole 1.02: 1(0,0) 2(0,-2.59) 3(0,-5.18) 4(0,-7.77) 5(0,-10.36) 6(0,-12.95) 7(0,-15.54) 8(0,-18.13) 9(0,-20.72) 10(0,-23.31) 11(0,-25.9) 12(0,-28.49) 13(0,-31.08) 14(0,-33.67) 15(0,-36.26) 16(0,-38.85) 17(17.78,-38.85) 18(17.78,-36.26) 19(17.78,-33.67) 20(17.78,-31.08) 21(17.78,-28.49) 22(17.78,-25.9) 23(17.78,-23.31) 24(17.78,-20.72) 25(17.78,-18.13) 26(17.78,-15.54) 27(17.78,-12.95) 28(17.78,-10.36) 29(17.78,-7.77) 30(17.78,-5.18) 31(17.78,-2.59) 32(17.78,0)
HDR-TH_6P-P2.54-V-M-1
  rect 1.8x1.8 hole 1.2: 1(-6.35,0)
  round 1.8 hole 1.2: 2(-3.81,0) 3(-1.27,0) 4(1.27,0) 5(3.81,0) 6(6.35,0)
Pad_e252
  round 1.524 hole 0.914: 1(0,0)
Pad_e253
  round 1.524 hole 0.914: 2(0,0)
Pad_e254
  round 1.524 hole 0.914: 3(0,0)
Pad_e255
  round 1.524 hole 0.914: 4(0,0)
Pad_e256
  round 1.524 hole 0.914: 5(0,0)
Pad_e328
  round 1.524 hole 0.914: 1(0,0)
RES-TH_BD1.8-L3.2-P7.20-D0.4
  round 1.2 hole 0.8: 1(-3.6,0) 2(3.6,0)
SOD-323_L1.7-W1.3-LS2.5-BI
  rect 0.8x0.8 smd: 1(-1.205,0) 2(1.205,0)
SOT-23-3_L2.9-W1.3-P0.95-LS2.4-BR
  rect 1.25x0.7 smd: 1(1,-0.95) 2(1,0.95) 3(-1,0)
SOT-23-3_L2.9-W1.3-P1.90-LS2.4-BR
  rect 1.25x0.7 smd: 1(1,-0.95) 2(1,0.95) 3(-1,0)
SOT-23-3_L2.9-W1.6-P1.90-LS2.8-BR
  rect 1.07x0.6 smd: 1(1.235,-0.95) 2(1.235,0.95) 3(-1.235,0)

## Nets
+3.3V: Q14.1 Q15.1 R5.2 R7.2 U1.31
+5V: Q13.2 R6.2 R8.2 U1.18 U2.9
GND: C1.1 Q13.1 R1.1 R2.1 U1.17 U2.7 U3.1 U4.2
VIN: C1.2 Q13.3 U3.2 U4.1
ADC_0: Q1.2 Q2.2 Q3.2 Q4.2 Q5.2 Q6.2 R1.2 U2.1
ADC_1: Q7.2 Q8.2 Q9.2 Q10.2 Q11.2 Q12.2 R2.2 U2.2
BOOT_BUTTON: U1.19
DIG_0: NOREF#2.1 Q6.1 Q12.1 U2.3
DIG_1: NOREF#5.1 Q5.1 Q11.1 U2.4
DIG_2: NOREF.2 Q1.1 Q7.1 U2.5
DIG_3: NOREF#4.3 Q2.1 Q8.1 U2.6
DIG_4: NOREF#3.4 Q3.1 Q9.1 U2.8
DIG_5: NOREF#6.5 Q4.1 Q10.1 U2.10
DOT_0: H3.1 Q6.3
DOT_1: H3.2 Q5.3
DOT_2: H3.3 Q1.3
DOT_3: H3.4 Q2.3
DOT_4: H3.5 Q3.3
DOT_5: H3.6 Q4.3
DOT_6: H4.1 Q12.3
DOT_7: H4.2 Q11.3
DOT_8: H4.3 Q7.3
DOT_9: H4.4 Q8.3
DOT_10: H4.5 Q9.3
DOT_11: H4.6 Q10.3
SCL_CH: Q14.3 R6.1 U2.12
SCL_ESP: Q14.2 R5.1 U1.29
SDA_CH: Q15.3 R8.1 U2.11
SDA_ESP: Q15.2 R7.1 U1.30

Pads without a net: U1 1 2 3 4 5 6 7 8 9 10 11 12 13 14 15 16 20 21 22 23 24 25 26 27 28 32; U2 13 14 15 16 17 18 19 20

## Routing (per net, layer and track width the routed paths; a pad name or vN(x,y) marks a point on that pad's centre or on a via; arc(x,y) is an arc through that point)
+3.3V: length 25.3
  Top Layer w0.254: Q14.1 12.88,36.87 R5.2 10.16,34.5 10.16,30.48 12.7,27.94 12.7,27.66 ; U1.31 16.67,26.88 R7.2 12.7,27.66 ; Q15.1 12.7,27.66
+5V: length 44.2
  Top Layer w0.254: Q13.2 20.62,64.5 U1.18 20.32,63.95 21.65,62.63 21.65,60.33 24.79,57.19 25.54,57.19 36.62,46.11 R6.2 ; R6.2 R8.2 ; R6.2 36.77,37.95 U2.9
GND: length 46.2
  Top Layer w0.254: U2.7 40.72,44.04 29.42,55.34 R2.1 R1.1 29.42,58.67 35.25,64.5 ; U1.17 24.06,66.79 Q13.1 28.3,64.5 29.95,66.15 31.09,66.15 32.74,64.5 35.25,64.5 ; 35.25,64.5 U3.1
VIN: length 6.9
  Top Layer w0.254: U3.2 30.66,64.63 30.66,63.68 30.48,63.5 26.4,63.5 Q13.3
ADC_0: length 44.7
  Top Layer w0.254: R1.2 40.56,58.42 U2.1 49.33,58.27 49.38,58.32 50.32,58.32 50.37,58.27 50.9,58.27 Q6.2 53.56,57.42 54.46,58.32 55.4,58.32 56.3,57.42 Q5.2 58.64,57.42 59.54,58.32 60.48,58.32 61.38,57.42 Q1.2 63.72,57.42 64.62,58.32 65.56,58.32 66.46,57.42 Q2.2 68.8,57.42 69.7,58.32 70.64,58.32 71.54,57.42 Q3.2 73.88,57.42 74.78,58.32 75.72,58.32 76.62,57.42 Q4.2
ADC_1: length 40.5
  Top Layer w0.254: R2.2 40.56,55.88 U2.2 45.92,55.73 Q12.2 47.84,54.34 48.74,53.44 49.68,53.44 50.58,54.34 Q11.2 52.92,54.34 53.82,53.44 54.76,53.44 55.66,54.34 Q7.2 58,54.34 58.9,53.44 59.84,53.44 60.74,54.34 Q8.2 63.08,54.34 63.98,53.44 64.92,53.44 65.82,54.34 Q9.2 68.16,54.34 69.06,53.44 70,53.44 70.9,54.34 Q10.2
DIG_0: length 12.5
  Top Layer w0.254: Q12.1 49.21,56.78 Q6.1
  Bottom Layer w0.254: NOREF#2.1 42.26,54.73 U2.3
DIG_1: length 18.7
  Top Layer w0.254: Q11.1 54.29,56.78 Q5.1
  Bottom Layer w0.254: NOREF#5.1 50.21,50.65 U2.4
DIG_2: length 24.8
  Top Layer w0.254: Q1.1 59.37,56.78 Q7.1
  Bottom Layer w0.254: U2.5 42.9,50.29 51.32,50.29 55.88,54.85 NOREF.2
DIG_3: length 31
  Top Layer w0.254: Q8.1 64.45,56.78 Q2.1
  Bottom Layer w0.254: NOREF#4.3 60.91,54.92 55.93,49.94 45.08,49.94 U2.6
DIG_4: length 38.2
  Top Layer w0.254: Q9.1 69.53,56.78 Q3.1
  Bottom Layer w0.254: U2.8 49.81,49.58 60.58,49.58 66.02,55.02 NOREF#3.4
DIG_5: length 45.3
  Top Layer w0.254: Q4.1 74.61,56.78 Q10.1
  Bottom Layer w0.254: U2.10 54.53,49.22 65.21,49.22 70.94,54.95 NOREF#6.5
DOT_0: length 8.2
  Top Layer w0.254: Q6.3 50.8,62.23 H3.1
DOT_1: length 7.1
  Top Layer w0.254: Q5.3 57.15,60.69 H3.2
DOT_2: length 7.1
  Top Layer w0.254: H3.3 60.96,64.77 Q1.3
DOT_3: length 8.2
  Top Layer w0.254: H3.4 66.04,62.23 Q2.3
DOT_4: length 9.3
  Top Layer w0.254: H3.5 64.77,65.77 Q3.3
DOT_5: length 11.6
  Top Layer w0.254: H3.6 69.58,66.04 Q4.3
DOT_6: length 9.3
  Top Layer w0.254: H4.1 54.61,45.99 Q12.3
DOT_7: length 8.2
  Top Layer w0.254: H4.2 57.15,48.53 Q11.3
DOT_8: length 7.1
  Top Layer w0.254: Q7.3 58.42,46.99 H4.3
DOT_9: length 7.1
  Top Layer w0.254: H4.4 63.5,46.99 Q8.3
DOT_10: length 8.2
  Top Layer w0.254: H4.5 68.58,49.53 Q9.3
DOT_11: length 9.3
  Top Layer w0.254: H4.6 67.31,45.99 Q10.3
SCL_CH: length 14.9
  Top Layer w0.254: R6.1 25.63,38.1 U2.12 24.09,39.34 21.63,39.34 21.49,39.48 19.15,39.48 19.01,39.34 Q14.3
SCL_ESP: length 13.4
  Top Layer w0.254: R5.1 12.7,40.36 Q14.2 17.34,35.71 U1.29
SDA_CH: length 15.8
  Top Layer w0.254: R8.1 25.63,35.56 U2.11 22.36,35.41 21.49,34.53 18.06,34.53 Q15.3
SDA_ESP: length 12
  Top Layer w0.254: U1.30 16.44,29.25 Q15.2 12.7,32.74 R7.1

# Board PCB2
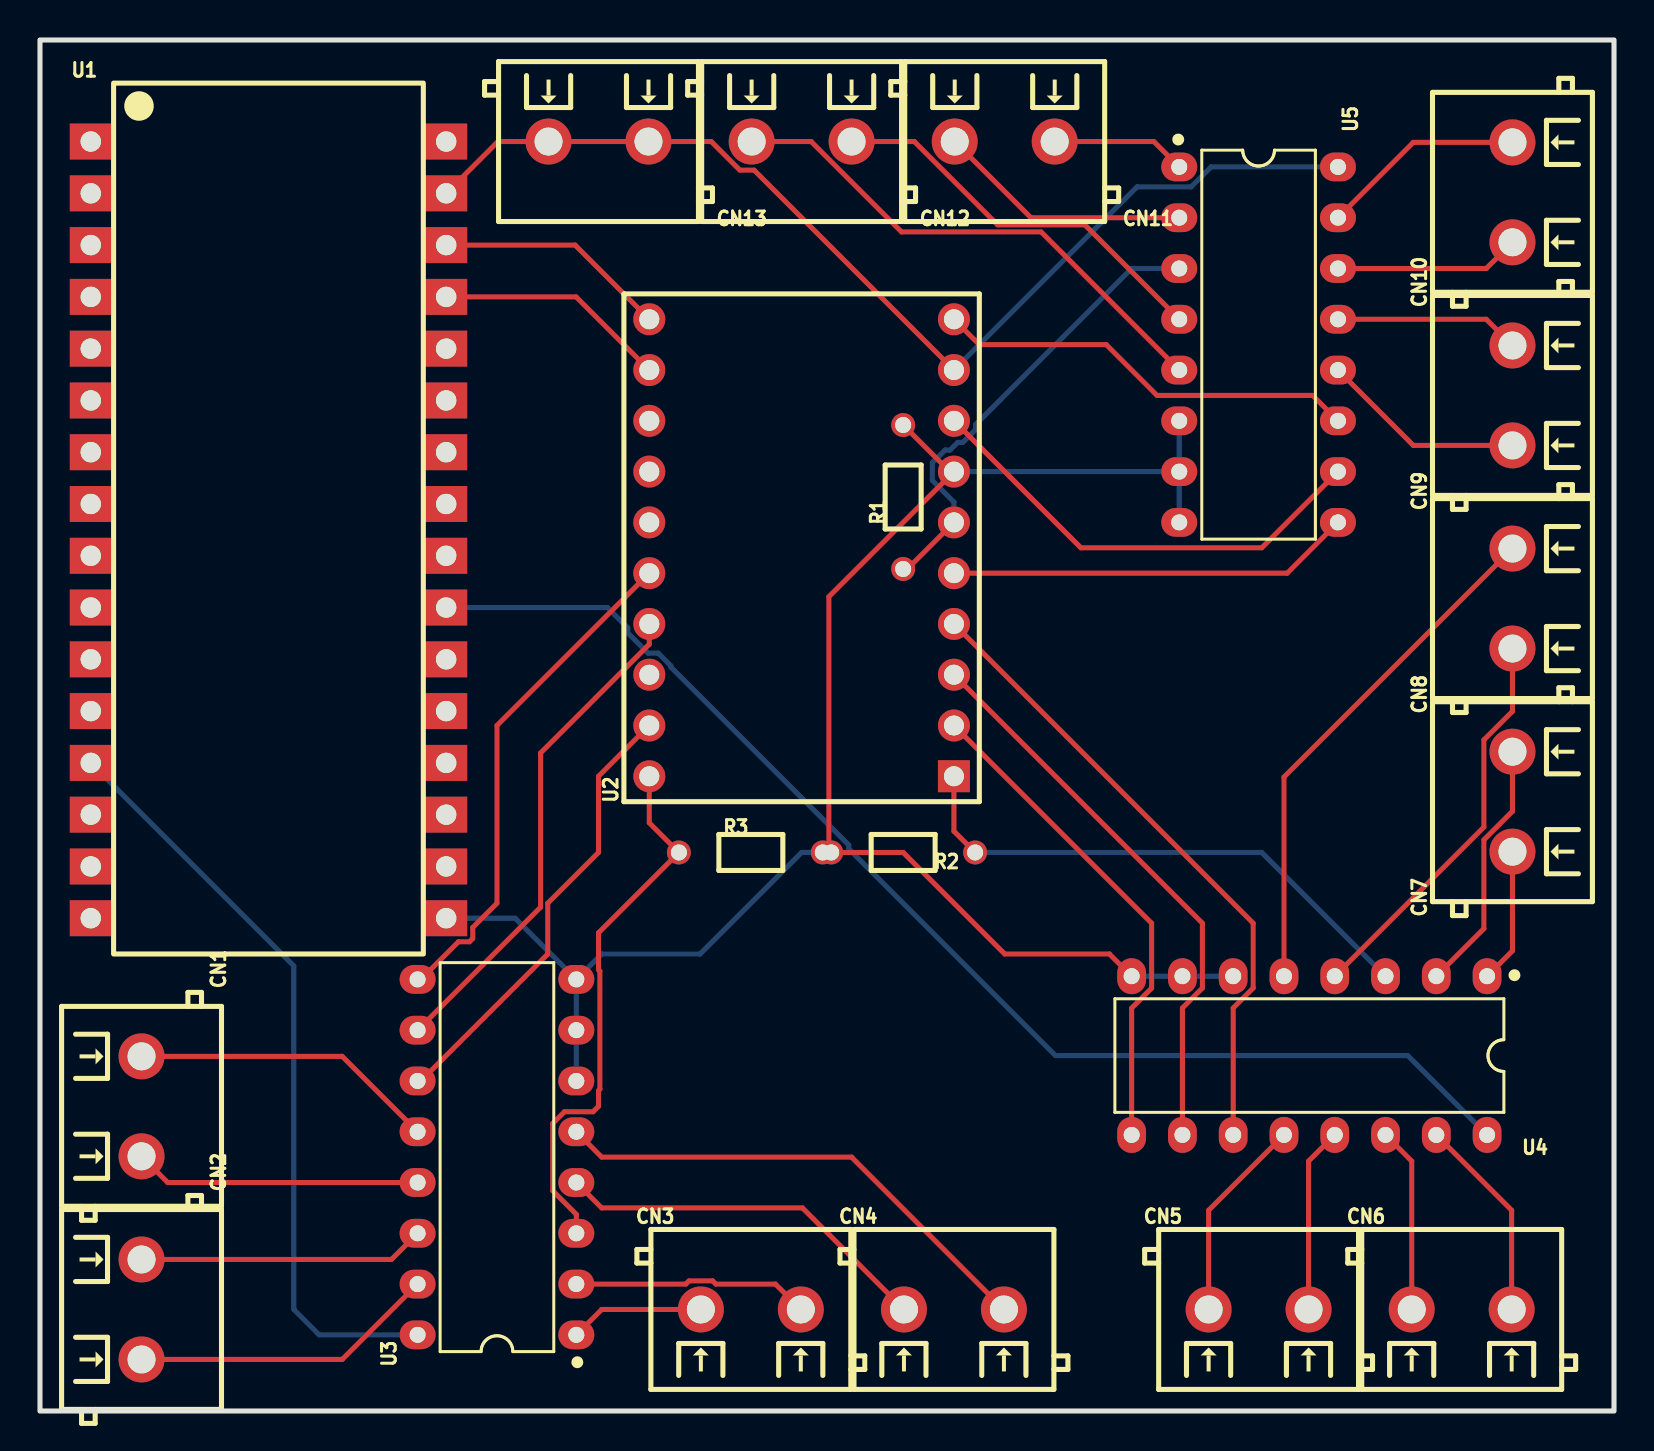
[diagram p4: board, top side]
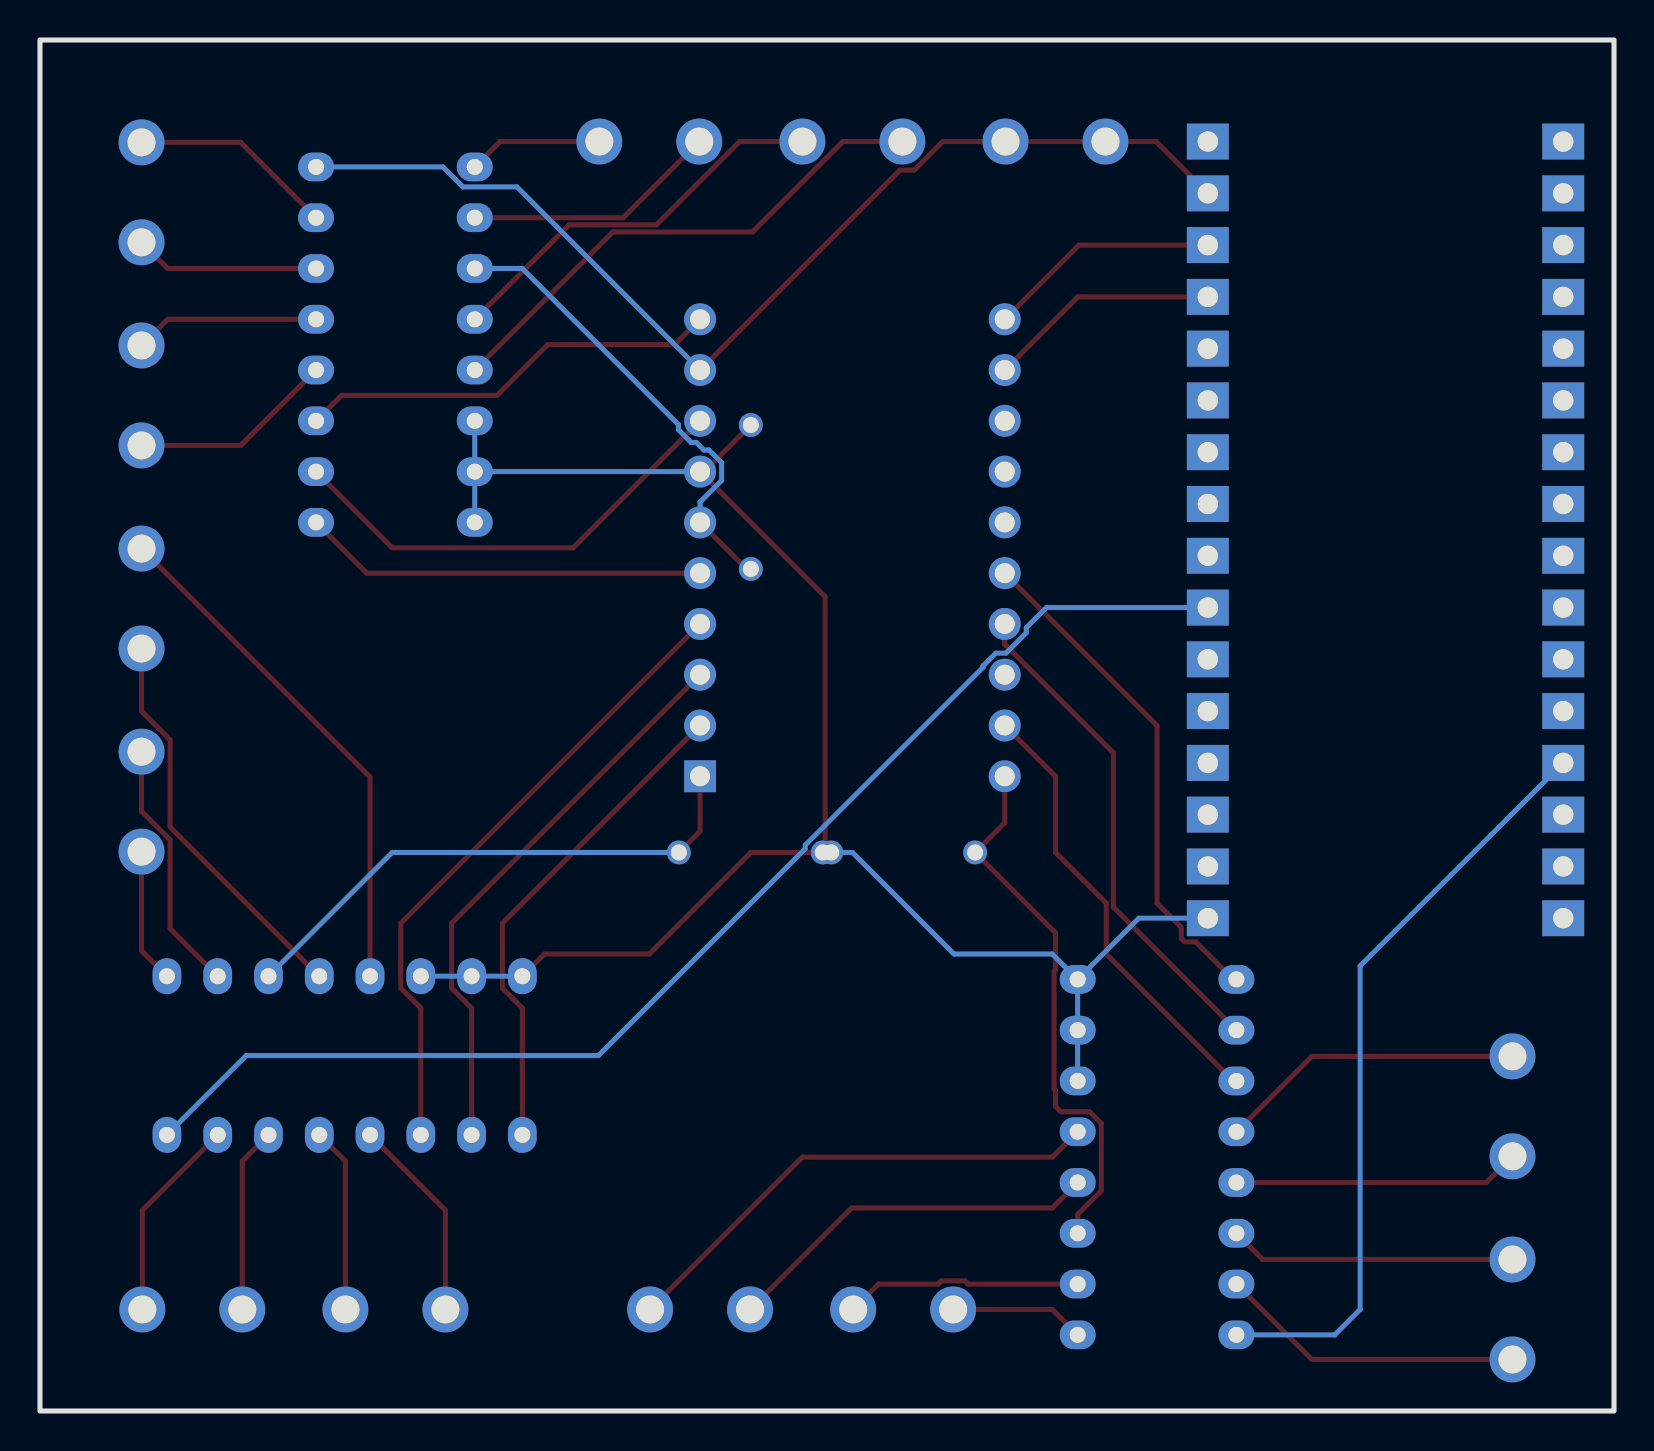
[diagram p5: board, bottom side, seen from below]

Outline 78.74 x 68.58 mm; copper layers: Top Layer, Bottom Layer. Coordinates in mm from the lower left corner of the outline.
Outline path: rectangle 0,68.58 78.74,0
Stack: Top Layer 0.035mm / Dielectric1 1.51mm FR4 er 4.5 / Bottom Layer 0.035mm

## Design rules (mm)
template: JLCPCB Capability(Two Layers Board)
spacing copperThickness1oz (default): track to track 0.102, other pairs 0.152 to 0.3
spacing copperThickness2oz: track to track 0.203, other pairs 0.152 to 0.3
track width copperThickness1oz (default): min 0.127, default 0.254, max 2.54
track width copperThickness2oz: min 0.203, default 0.254, max 2.54
differential pair differentialPair (default): width min 0.127, default 0.254, max 2.54; gap min 0.152, default 0.152
via viaSize (default): diameter min 0.5, default 0.61, max 10; hole min 0.3, default 0.305, max 6.3

## Placement (name value [footprint] x y rotation side)
CN1  DGL500-2P26V-MG561  [CONN-TH_2P-P5.00_DGL500-2P26V-MG561]  5.08 15.24 270 top
CN2  DGL500-2P26V-MG561  [CONN-TH_2P-P5.00_DGL500-2P26V-MG561]  5.08 5.08 270 top
CN3  DGL500-2P26V-MG561  [CONN-TH_2P-P5.00_DGL500-2P26V-MG561]  35.56 5.08 0 top
CN4  DGL500-2P26V-MG561  [CONN-TH_2P-P5.00_DGL500-2P26V-MG561]  45.72 5.08 0 top
CN5  DGL500-2P26V-MG561  [CONN-TH_2P-P5.00_DGL500-2P26V-MG561]  60.96 5.08 0 top
CN6  DGL500-2P26V-MG561  [CONN-TH_2P-P5.00_DGL500-2P26V-MG561]  71.12 5.08 0 top
CN7  DGL500-2P26V-MG561  [CONN-TH_2P-P5.00_DGL500-2P26V-MG561]  73.66 30.48 90 top
CN8  DGL500-2P26V-MG561  [CONN-TH_2P-P5.00_DGL500-2P26V-MG561]  73.66 40.64 90 top
CN9  DGL500-2P26V-MG561  [CONN-TH_2P-P5.00_DGL500-2P26V-MG561]  73.66 50.8 90 top
CN10  DGL500-2P26V-MG561  [CONN-TH_2P-P5.00_DGL500-2P26V-MG561]  73.66 60.96 90 top
CN11  DGL500-2P26V-MG561  [CONN-TH_2P-P5.00_DGL500-2P26V-MG561]  48.26 63.5 180 top
CN12  DGL500-2P26V-MG561  [CONN-TH_2P-P5.00_DGL500-2P26V-MG561]  38.1 63.5 180 top
CN13  DGL500-2P26V-MG561  [CONN-TH_2P-P5.00_DGL500-2P26V-MG561]  27.94 63.5 180 top
R1  3.3K  [RES-TH_BD1.8-L3.2-P7.20-D0.4]  43.18 45.72 90 top
R2  3.3K  [RES-TH_BD1.8-L3.2-P7.20-D0.4]  43.18 27.94 180 top
R3  3.3K  [RES-TH_BD1.8-L3.2-P7.20-D0.4]  35.56 27.94 0 top
U1  -  [ESP32C3 LUATOS FOOT]  2.54 63.5 0 top
U2  8f00a198f97b47c4b71384159009efba  [DIP-20_L25.4-W17.7-P2.54-LS15.2-BL]  38.1 43.18 90 top
U3  74HC4051N  [PDIP-16_L19.3-W6.4-P2.54-LS7.94-BL]  22.86 12.7 90 top
U4  74HC4051N  [PDIP-16_L19.3-W6.4-P2.54-LS7.94-BL]  63.5 17.78 180 top
U5  74HC4051N  [PDIP-16_L19.3-W6.4-P2.54-LS7.94-BL]  60.96 53.34 270 top

## Footprints (pads in the part's own frame, mm; a bottom-side part is the same pattern mirrored in y, then rotated)
CONN-TH_2P-P5.00_DGL500-2P26V-MG561
  round 2.3 hole 1.4: 1(-2.5,0) 2(2.5,0)
DIP-20_L25.4-W17.7-P2.54-LS15.2-BL
  rect 1.6x1.6 hole 1: 1(-11.428,-7.62)
  round 1.6 hole 1: 2(-8.89,-7.62) 3(-6.35,-7.62) 4(-3.81,-7.62) 5(-1.27,-7.62) 6(1.27,-7.62) 7(3.81,-7.62) 8(6.35,-7.62) 9(8.89,-7.62) 10(11.43,-7.62) 11(11.43,7.62) 12(8.89,7.62) 13(6.35,7.62) 14(3.81,7.62) 15(1.27,7.62) 16(-1.27,7.62) 17(-3.81,7.62) 18(-6.35,7.62) 19(-8.89,7.62) 20(-11.43,7.62)
ESP32C3 LUATOS FOOT
  rect 2.1x1.8 hole 1.02: 1(0,0) 2(0,-2.59) 3(0,-5.18) 4(0,-7.77) 5(0,-10.36) 6(0,-12.95) 7(0,-15.54) 8(0,-18.13) 9(0,-20.72) 10(0,-23.31) 11(0,-25.9) 12(0,-28.49) 13(0,-31.08) 14(0,-33.67) 15(0,-36.26) 16(0,-38.85) 17(17.78,-38.85) 18(17.78,-36.26) 19(17.78,-33.67) 20(17.78,-31.08) 21(17.78,-28.49) 22(17.78,-25.9) 23(17.78,-23.31) 24(17.78,-20.72) 25(17.78,-18.13) 26(17.78,-15.54) 27(17.78,-12.95) 28(17.78,-10.36) 29(17.78,-7.77) 30(17.78,-5.18) 31(17.78,-2.59) 32(17.78,0)
PDIP-16_L19.3-W6.4-P2.54-LS7.94-BL
  oval 1.44x1.8 hole 0.8: 1(-8.89,-3.97) 2(-6.35,-3.97) 3(-3.81,-3.97) 4(-1.27,-3.97) 5(1.27,-3.97) 6(3.81,-3.97) 7(6.35,-3.97) 8(8.89,-3.97) 9(8.89,3.97) 10(6.35,3.97) 11(3.81,3.97) 12(1.27,3.97) 13(-1.27,3.97) 14(-3.81,3.97) 15(-6.35,3.97) 16(-8.89,3.97)
RES-TH_BD1.8-L3.2-P7.20-D0.4
  round 1.2 hole 0.8: 1(-3.6,0) 2(3.6,0)

## Nets
As in the schematic, except:
GND: R1.2 R2.2 R3.2 U1.17 U1.24 U2.7 U3.6 U3.7 U3.8 U4.6 U4.7 U4.8 U5.6 U5.7 U5.8
ADC_1: R3.1 U2.20 U3.3
ADC_2: R2.1 U2.1 U4.3
ADC_3: R1.1 U2.6 U5.3

Pads without a net: U1 1 2 3 4 5 6 7 8 9 10 11 12 14 15 16 18 20 21 22 25 26 27 28 32; U2 13 14 15 18

## Routing (per net, layer and track width the routed paths; a pad name or vN(x,y) marks a point on that pad's centre or on a via; arc(x,y) is an arc through that point)
+3.3V: length 156.2
  Top Layer w0.254: U2.9 35.72,62.07 35.01,62.07 33.58,63.5 CN13.1 CN13.2 22.91,63.5 U1.31
  Bottom Layer w0.254: U5.16 58.58,62.23 57.58,61.23 54.88,61.23 U2.9 ; U4.16 68.42,17.78 50.8,17.78 40.46,28.12 40.46,28.3 31.56,37.2 31.56,37.28 30.93,37.91 30.41,37.91 29.4,38.92 29.4,39.18 28.39,40.19 U1.23 ; U1.13 12.7,22.26 12.7,5.08 13.97,3.81 U3.16
GND: length 92.4
  Top Layer w0.254: 39.46,27.94 R3.2 ; 39.46,27.94 39.46,40.73 U2.7 45.51,46.99 R1.2 ; 39.46,27.94 43.18,27.94 48.26,22.86 53.5,22.86 U4.8
  Bottom Layer w0.254: R3.2 38.1,27.94 33.02,22.86 28.1,22.86 U3.8 ; U1.17 23.77,24.65 U3.8 ; U2.7 U5.7 ; U5.7 U5.6 ; U5.7 U5.8 ; U3.8 U3.7 U3.6 ; U4.8 U4.7 U4.6
ADC_1: length 27.5
  Top Layer w0.254: U3.3 26.83,9.84 25.65,11.02 25.65,14.38 26.24,14.97 27.67,14.97 27.94,15.24 27.94,16.03 28.01,16.1 28.01,22 27.94,22.07 27.94,23.92 R3.1 30.48,29.42 U2.20
ADC_2: length 27.3
  Top Layer w0.254: U2.1 45.72,29 R2.1
  Bottom Layer w0.254: R2.1 61.12,27.94 U4.3
ADC_3: length 23.5
  Top Layer w0.254: R1.1 43.39,42.12 U2.6
  Bottom Layer w0.254: U5.3 54.61,57.15 46.8,49.34 46.8,49.08 46.17,48.45 45.91,48.45 45.53,48.07 45.27,48.07 44.64,47.44 44.64,46.54 45.72,45.46 U2.6
DIG_1: length 22.7
  Top Layer w0.254: U2.19 27.94,31.75 27.94,27.94 25.4,25.4 25.4,22.86 19.05,16.51 U3.11
DIG_2: length 25.1
  Top Layer w0.254: U3.10 25.04,25.2 25.04,32.92 30.48,38.36 U2.17
DIG_3: length 25.5
  Top Layer w0.254: U2.16 22.86,34.29 22.86,25.4 21.65,24.19 21.65,23.63 21.49,23.47 20.93,23.47 19.05,21.59 U3.9
DIG_4: length 32.2
  Top Layer w0.254: U4.11 59.69,20.16 60.69,21.16 60.69,24.4 U2.4
DIG_5: length 28.6
  Top Layer w0.254: U4.10 57.15,20.16 58.15,21.16 58.15,24.4 U2.3
DIG_6: length 25
  Top Layer w0.254: U4.9 54.61,20.16 55.61,21.16 55.61,24.4 U2.2
DIG_7: length 21.3
  Top Layer w0.254: U2.10 46.99,53.34 53.34,53.34 55.88,50.8 63.66,50.8 U5.11
DIG_8: length 23.4
  Top Layer w0.254: U2.8 52.07,43.18 61.12,43.18 U5.10
DIG_9: length 20.3
  Top Layer w0.254: U5.9 62.39,41.91 U2.5
SCL: length 11.7
  Top Layer w0.254: U1.29 26.82,55.73 U2.12
SDA: length 11.7
  Top Layer w0.254: U1.30 26.77,58.32 U2.11
SIGNAL_1: length 14.4
  Top Layer w0.254: CN1.2 6.39,11.43 U3.13
SIGNAL_2: length 14.4
  Top Layer w0.254: CN2.1 17.58,7.58 U3.14
SIGNAL_3: length 15.4
  Top Layer w0.254: CN2.2 15.12,2.58 U3.15
SIGNAL_4: length 15.4
  Top Layer w0.254: U3.12 15.12,17.74 CN1.1
SIGNAL_5: length 6.8
  Top Layer w0.254: CN3.1 28.1,5.08 U3.1
SIGNAL_6: length 25.1
  Top Layer w0.254: CN4.2 40.6,12.7 28.1,12.7 U3.5
SIGNAL_7: length 11.9
  Top Layer w0.254: CN3.2 36.79,6.35 33.81,6.35 33.65,6.51 32.47,6.51 32.31,6.35 U3.2
SIGNAL_8: length 19
  Top Layer w0.254: U3.4 28.1,10.16 38.14,10.16 CN4.1
SIGNAL_9: length 9.3
  Top Layer w0.254: CN5.2 63.46,12.5 U4.13
SIGNAL_10: length 9.3
  Top Layer w0.254: U4.14 68.62,12.5 CN6.1
SIGNAL_11: length 10.3
  Top Layer w0.254: U4.15 73.62,10.04 CN6.2
SIGNAL_12: length 10.3
  Top Layer w0.254: U4.12 58.46,10.04 CN5.1
SIGNAL_13: length 6.8
  Top Layer w0.254: CN7.1 73.66,23.02 U4.1
SIGNAL_14: length 26.1
  Top Layer w0.254: CN8.2 62.23,31.71 U4.5
SIGNAL_15: length 12.8
  Top Layer w0.254: U4.2 72.23,24.13 72.23,28.57 73.66,30 CN7.2
SIGNAL_16: length 20.1
  Top Layer w0.254: U4.4 72.23,29.21 72.23,33.57 73.66,35 CN8.1
SIGNAL_17: length 9.3
  Top Layer w0.254: U5.13 72.35,54.61 CN9.2
SIGNAL_18: length 9.3
  Top Layer w0.254: U5.14 72.35,57.15 CN10.1
SIGNAL_19: length 10.3
  Top Layer w0.254: CN10.2 68.7,63.46 U5.15
SIGNAL_20: length 10.3
  Top Layer w0.254: CN9.1 68.7,48.3 U5.12
SIGNAL_21: length 6.8
  Top Layer w0.254: CN11.1 55.72,63.5 U5.1
SIGNAL_22: length 26.1
  Top Layer w0.254: CN12.2 38.58,63.5 43.1,58.98 50.08,58.98 U5.5
SIGNAL_23: length 12.8
  Top Layer w0.254: CN11.2 49.57,59.69 U5.2
SIGNAL_24: length 20.1
  Top Layer w0.254: CN12.1 43.74,63.5 47.91,59.33 52.27,59.33 U5.4
